# EAGLE schematic ACU rev1 (EAGLE 9.6.2)

## Sheet 1 of 5: Connectors, Power Fusing, TSAL
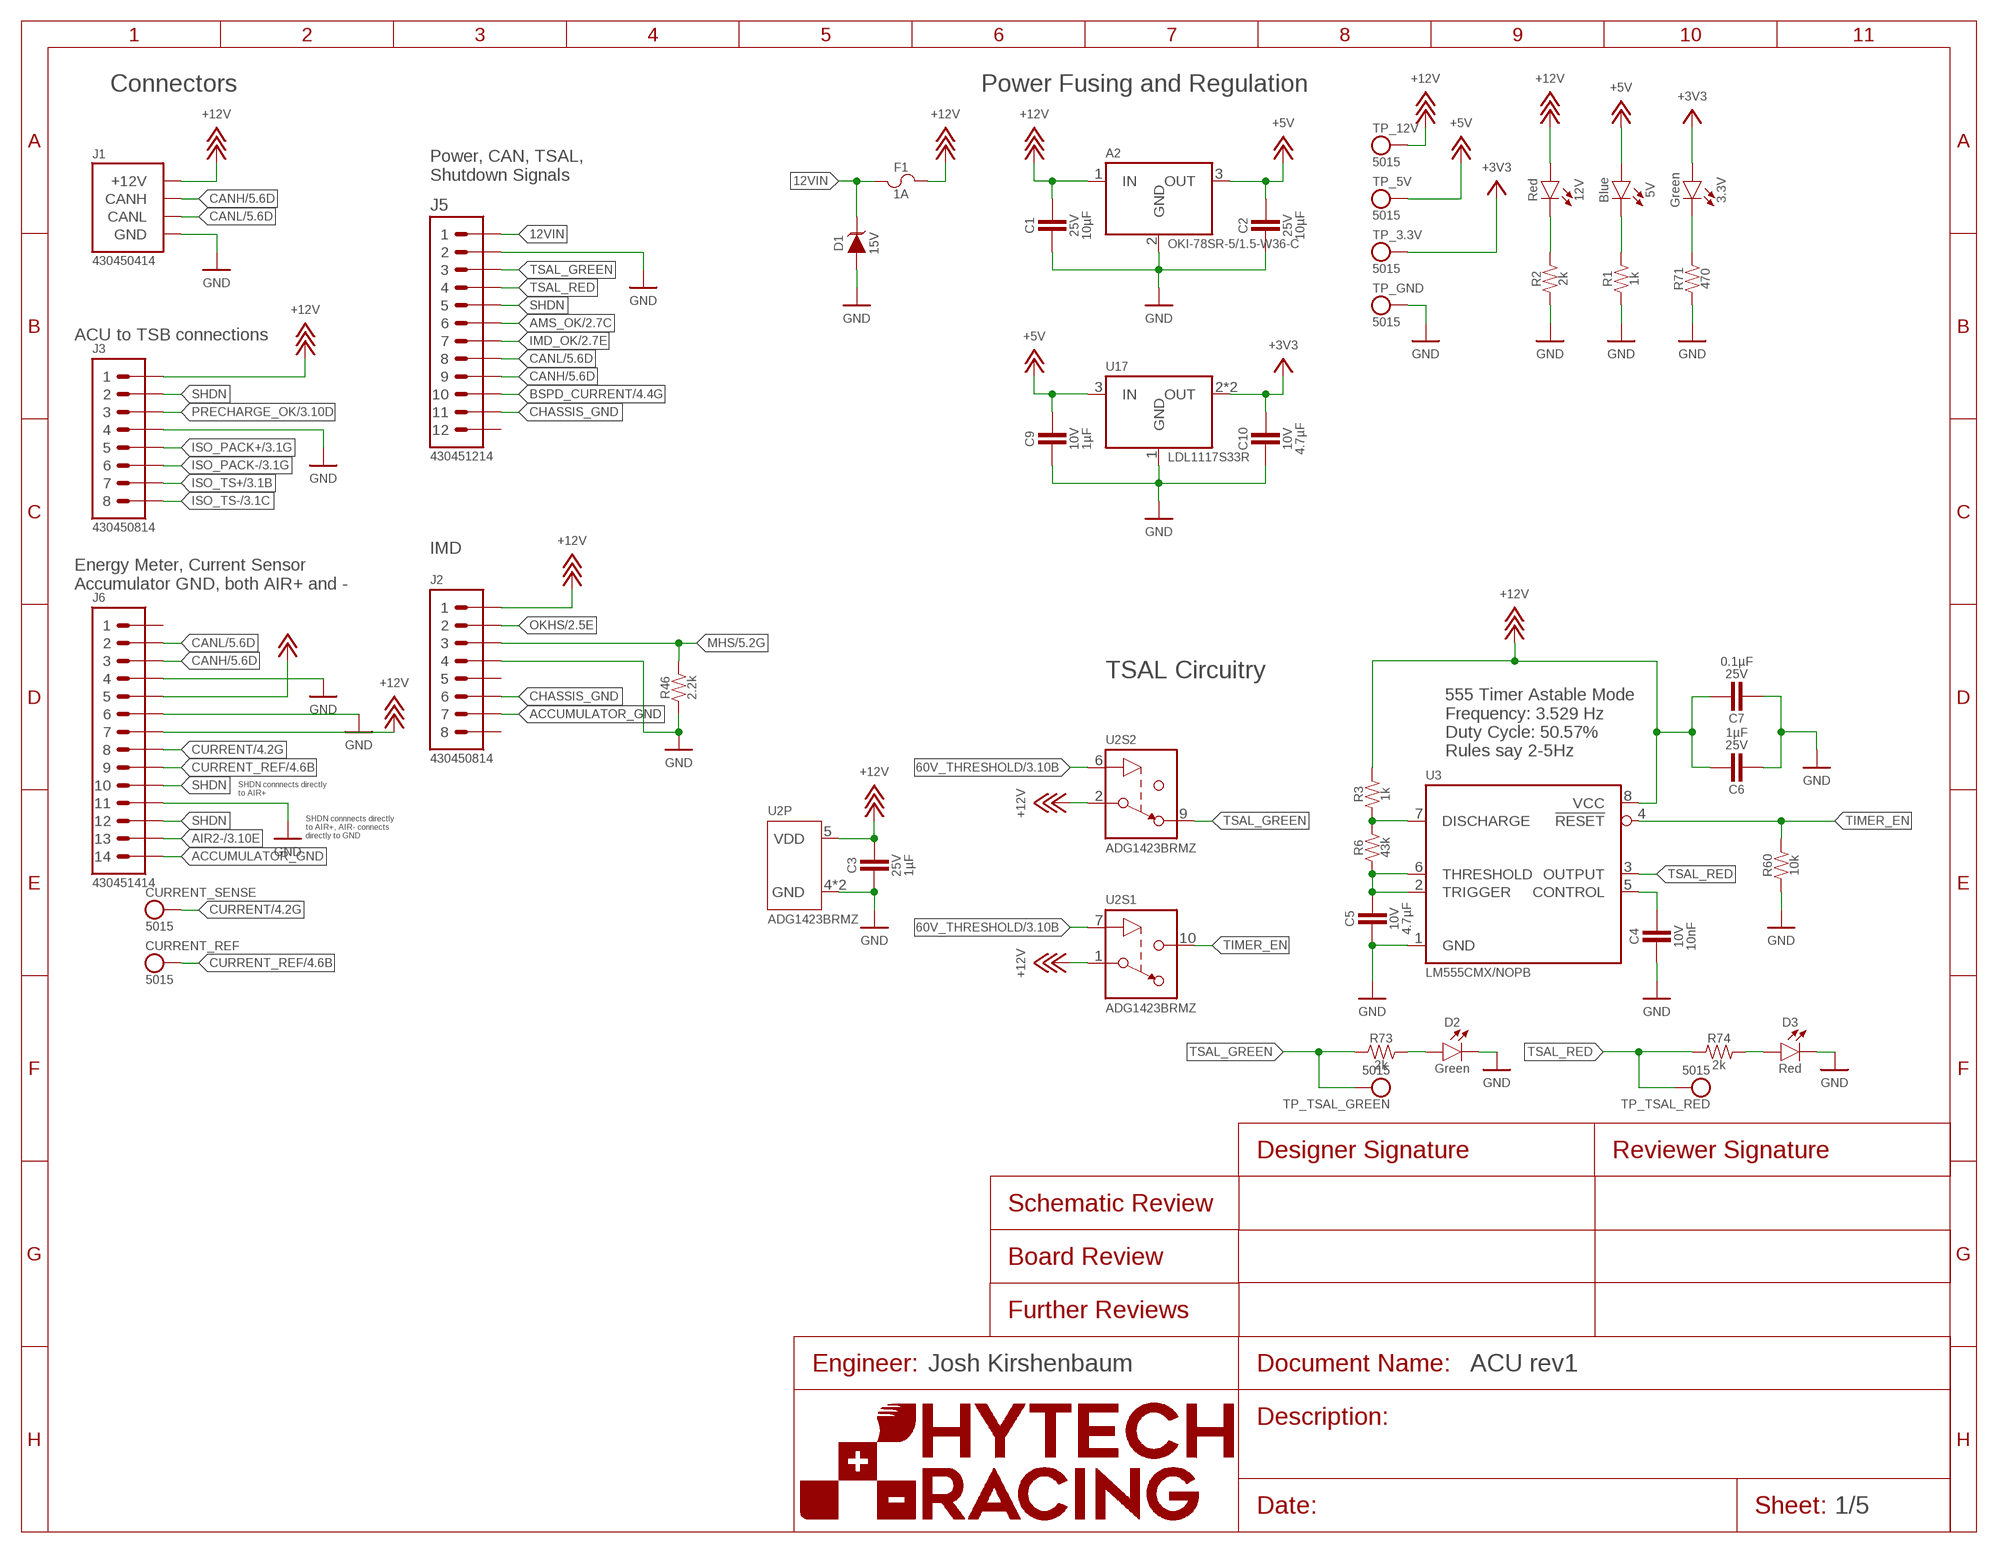
[diagram p0: schematic, sheet 1]

### Parts
3.3V  LED_0603_GREEN  [0603-LED]
5V  LED_0603_BLUE  [0603-LED]
12V  LED_0603_RED  [0603-LED]
A2  VOLTAGE_REGULATOR_MODULE_OKI-78SR_5V  [OKI-78SR]
C1  CAPACITOR_0603_25V_10UF  [0603-CAP]
C2  CAPACITOR_0603_25V_10UF  [0603-CAP]
C3  CAPACITOR_0603_25V_1UF  [0603-CAP]
C4  CAPACITOR_0603_10V_10NF  [0603-CAP]
C5  CAPACITOR_0603_10V_4.7UF  [0603-CAP]
C6  CAPACITOR_0603_25V_1UF  [0603-CAP]
C7  CAPACITOR_0603_25V_0.1UF  [0603-CAP]
C9  CAPACITOR_0603_10V_1UF  [0603-CAP]
C10  CAPACITOR_0603_10V_4.7UF  [0603-CAP]
CURRENT_REF  TEST_POINT  [MICRO_MINIATURE]
CURRENT_SENSE  TEST_POINT  [MICRO_MINIATURE]
D1  TVS_15V  [SOT-23]
D2  LED_0603_GREEN  [0603-LED]
D3  LED_0603_RED  [0603-LED]
F1  FUSE_MINI-BLADE_1A  [MINI-BLADE_FUSE_HOLDER]
J1  CONNECTOR-CAN_MF_T_V_  [MOLEX_MICROFIT_PTH_VERTICAL_04_DUAL]
J2  CONNECTOR-8_MF_T_V_  [MOLEX_MICROFIT_PTH_VERTICAL_08_DUAL]
J3  CONNECTOR-8_MF_T_V_  [MOLEX_MICROFIT_PTH_VERTICAL_08_DUAL]
J5  CONNECTOR-12_MF_T_V_  [MOLEX_MICROFIT_PTH_VERTICAL_12_DUAL]
J6  CONNECTOR-14_MF_T_V_  [MOLEX_MICROFIT_PTH_VERTICAL_14_DUAL]
R1  RESISTOR_0603_1K  [0603-RES]
R2  RESISTOR_0603_2K  [0603-RES]
R3  RESISTOR_0603_1K  [0603-RES]
R6  RESISTOR_0603_43K  [0603-RES]
R46  RESISTOR_0603_2.2K  [0603-RES]
R60  RESISTOR_0603_10K  [0603-RES]
R71  RESISTOR_0603_470  [0603-RES]
R73  RESISTOR_0603_2K  [0603-RES]
R74  RESISTOR_0603_2K  [0603-RES]
TP_3.3V  TEST_POINT  [MICRO_MINIATURE]
TP_5V  TEST_POINT  [MICRO_MINIATURE]
TP_12V  TEST_POINT  [MICRO_MINIATURE]
TP_GND  TEST_POINT  [MICRO_MINIATURE]
TP_TSAL_GREEN  TEST_POINT  [MICRO_MINIATURE]
TP_TSAL_RED  TEST_POINT  [MICRO_MINIATURE]
U2  ADG1423  [MSOP-10]
U3  LM555  [SOIC-08(NARROW,0.15")]
U17  VOLTAGE_REGULATOR_SOT223_3.3V  [SOT223]

### Nets
12VIN: D1.3(C) F1.L1 F1.L2 J5.1
60V_THRESHOLD: U2.6(S2:IN) U2.7(S1:IN) ; also sheet 3
+3V3: 3.3V.2(A) C10.1 TP_3.3V.1 U17.2(OUT) U17.4(OUT) ; also sheet 4,5
+5V: 5V.2(A) A2.3(OUT) C2.1 C9.1 J6.5 TP_5V.1 U17.3(IN) ; also sheet 3,5
+12V: 12V.2(A) A2.1(IN) C1.1 C3.1 C6.1 C7.1 F1.R1 F1.R2 J1.1(+12V) J2.1 J3.1 J6.7 R3.2 TP_12V.1 U2.1(S1:S) U2.2(S2:S) U2.5(P:VDD) U3.8(VCC) ; also sheet 2,4,5
ACCUMULATOR_GND: J2.7 J6.14
AIR2-: J6.13 ; also sheet 3
AMS_OK: J5.6 ; also sheet 2
BSPD_CURRENT: J5.10 ; also sheet 4,5
CANH: J1.4(CANH) J5.9 J6.3 ; also sheet 5
CANL: J1.3(CANL) J5.8 J6.2 ; also sheet 5
CHASSIS_GND: J2.6 J5.11
CURRENT: CURRENT_SENSE.1 J6.8 ; also sheet 4
CURRENT_REF: CURRENT_REF.1 J6.9 ; also sheet 4
GND: A2.2(GND) C1.2 C2.2 C3.2 C4.2 C5.2 C6.2 C7.2 C9.2 C10.2 D1.1(A) D2.1(C) D3.1(C) J1.2(GND) J2.4 J3.4 J5.2 J6.4 J6.6 J6.11 R1.1 R2.1 R46.1 R60.1 R71.1 TP_GND.1 U2.4(P:GND) U2.8(P:GND) U3.1(GND) U17.1(GND) ; also sheet 2,3,4,5
IMD_OK: J5.7 ; also sheet 2,5
ISO_PACK+: J3.5 ; also sheet 3
ISO_PACK-: J3.6 ; also sheet 3
ISO_TS+: J3.7 ; also sheet 3
ISO_TS-: J3.8 ; also sheet 3
MHS: J2.3 R46.2 ; also sheet 5
N$1: 3.3V.1(C) R71.2
N$2: 5V.1(C) R1.2
N$3: C5.1 R6.1 U3.2(TRIGGER) U3.6(THRESHOLD)
N$5: C4.1 U3.5(CONTROL)
N$6: R3.1 R6.2 U3.7(DISCHARGE)
N$14: 12V.1(C) R2.2
N$24: D2.2(A) R73.2
N$46: D3.2(A) R74.2
OKHS: J2.2 ; also sheet 2
PRECHARGE_OK: J3.3 ; also sheet 3,5
SHDN: J3.2 J5.5 J6.10 J6.12
TIMER_EN: R60.2 U2.10(S1:D) U3.4(!RESET)
TSAL_GREEN: J5.3 R73.1 TP_TSAL_GREEN.1 U2.9(S2:D)
TSAL_RED: J5.4 R74.1 TP_TSAL_RED.1 U3.3(OUTPUT)
Unconnected: J2.5 J2.8 J5.12 J6.1

### Notes on the sheet
- Connectors | Power Fusing and Regulation
- Power, CAN, TSAL, 
  Shutdown Signals
- ACU to TSB connections
- IMD
- Energy Meter, Current Sensor
  Accumulator GND, both AIR+ and -
- TSAL Circuitry
- 555 Timer Astable Mode
  Frequency: 3.529 Hz
  Duty Cycle: 50.57%
  Rules say 2-5Hz
- SHDN connnects directly
  to AIR+
- SHDN connnects directly
  to AIR+, AIR- connects
  directly to GND
- Josh Kirshenbaum

## Sheet 2 of 5: Shutdown Circuitry
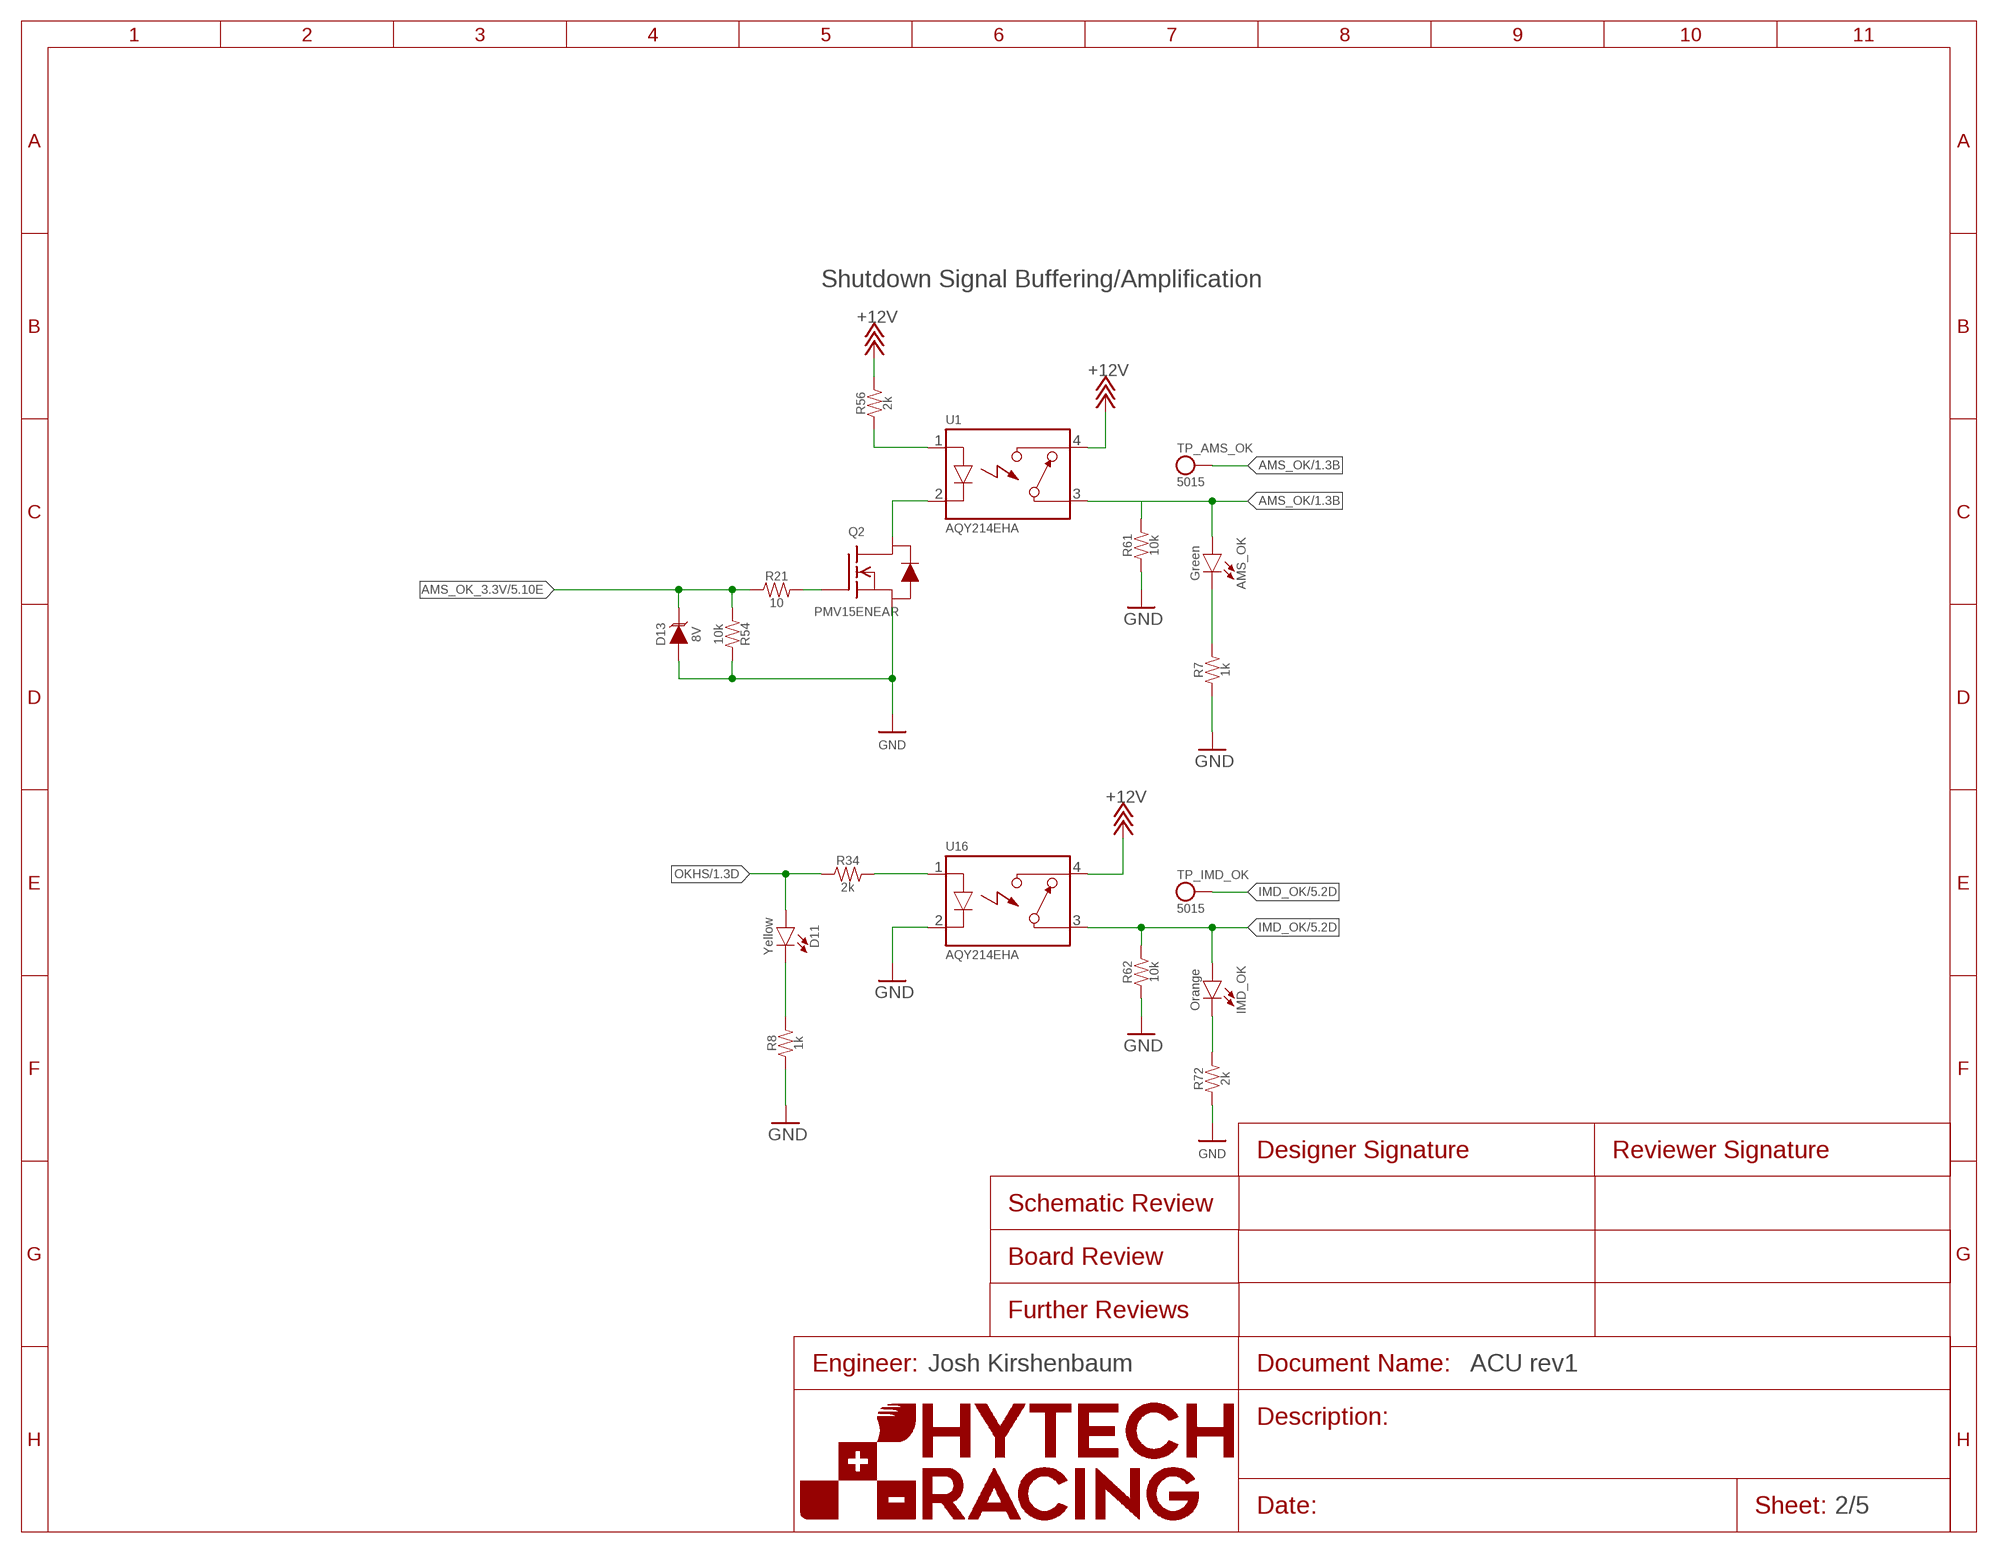
[diagram p1: schematic, sheet 2]

### Parts
AMS_OK  LED_0603_GREEN  [0603-LED]
D11  LED_0603_YELLOW  [0603-LED]
D13  TVS_8V  [SOT-23]
IMD_OK  LED_0603_ORANGE  [0603-LED]
Q2  TRANSISTOR_N_MOS__PMV15ENEA  [SOT-23]
R7  RESISTOR_0603_1K  [0603-RES]
R8  RESISTOR_0603_1K  [0603-RES]
R21  RESISTOR_0603_10  [0603-RES]
R34  RESISTOR_0603_2K  [0603-RES]
R54  RESISTOR_0603_10K  [0603-RES]
R56  RESISTOR_0603_2K  [0603-RES]
R61  RESISTOR_0603_10K  [0603-RES]
R62  RESISTOR_0603_10K  [0603-RES]
R72  RESISTOR_0603_2K  [0603-RES]
TP_AMS_OK  TEST_POINT  [MICRO_MINIATURE]
TP_IMD_OK  TEST_POINT  [MICRO_MINIATURE]
U1  RELAY_SOLIDSTATE_NO  [DIP-4]
U16  RELAY_SOLIDSTATE_NO  [DIP-4]

### Nets
+12V: R56.2 U1.4(CONTACT2) U16.4(CONTACT2) ; also sheet 1,4,5
AMS_OK: AMS_OK.2(A) R61.2 TP_AMS_OK.1 U1.3(CONTACT1) ; also sheet 1
AMS_OK_3.3V: D13.3(C) R21.1 R54.1 ; also sheet 5
GND: D13.1(A) Q2.2(S) R7.1 R8.1 R54.2 R61.1 R62.1 R72.1 U16.2(CONTROL-) ; also sheet 1,3,4,5
IMD_OK: IMD_OK.2(A) R62.2 TP_IMD_OK.1 U16.3(CONTACT1) ; also sheet 1,5
N$8: R34.2 U16.1(CONTROL+)
N$9: D11.1(C) R8.2
N$16: R56.1 U1.1(CONTROL+)
N$17: AMS_OK.1(C) R7.2
N$20: Q2.3(D) U1.2(CONTROL-)
N$27: IMD_OK.1(C) R72.2
N$30: Q2.1(G) R21.2
OKHS: D11.2(A) R34.1 ; also sheet 1

### Notes on the sheet
- Shutdown Signal Buffering/Amplification
- Josh Kirshenbaum

## Sheet 3 of 5: Precharge Circuit
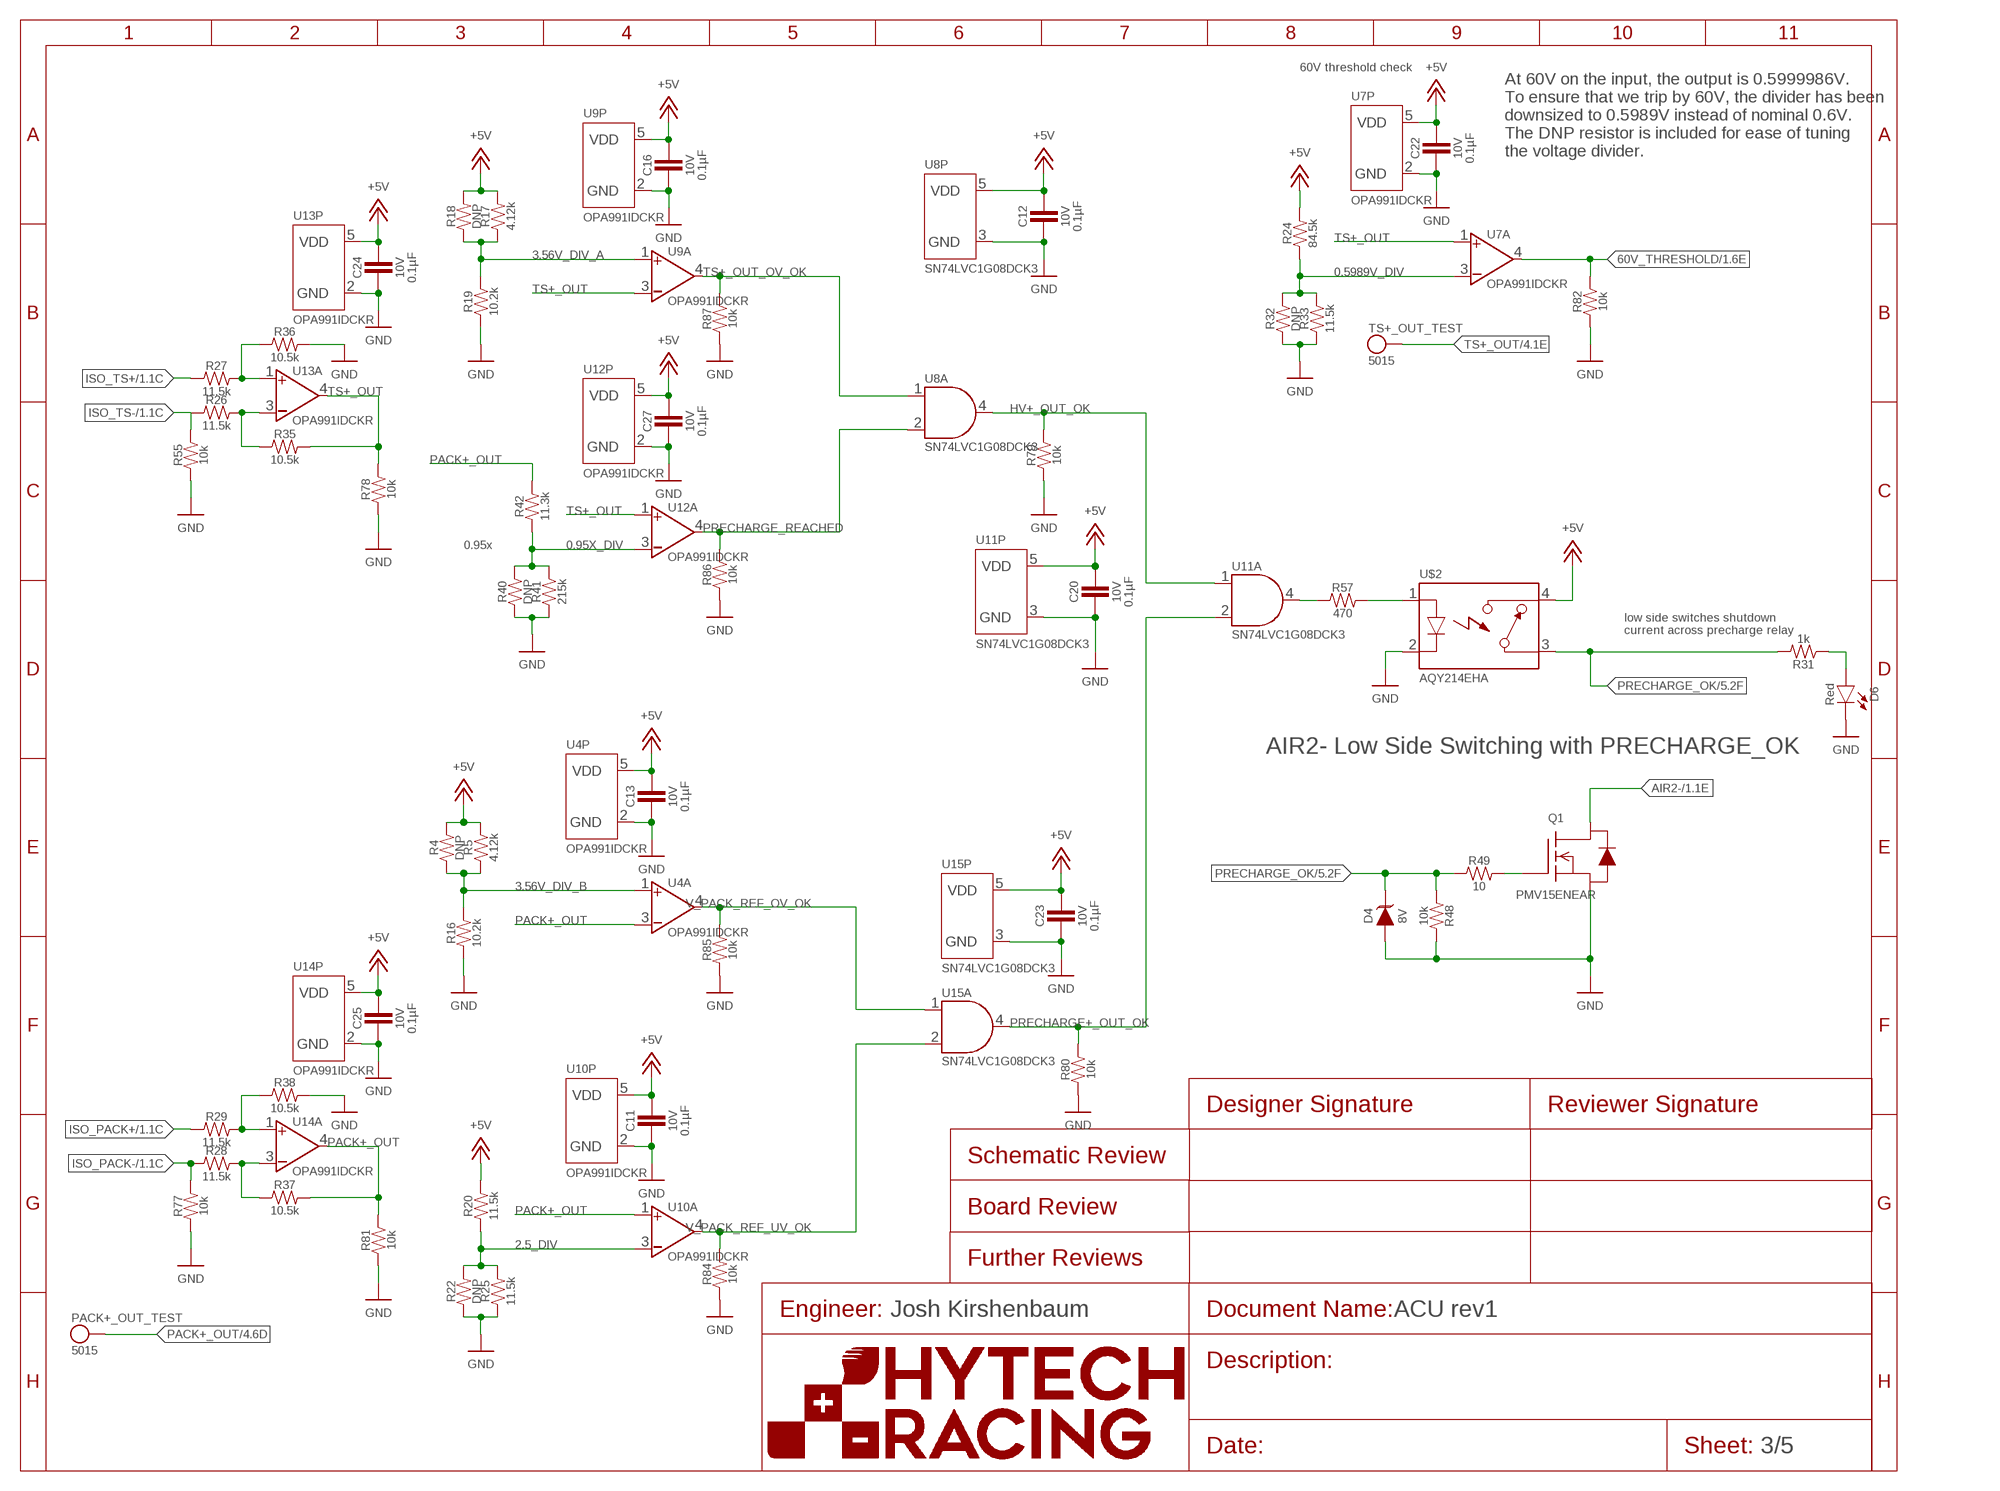
[diagram p2: schematic, sheet 3]

### Parts
C11  CAPACITOR_0603_10V_0.1UF  [0603-CAP]
C12  CAPACITOR_0603_10V_0.1UF  [0603-CAP]
C13  CAPACITOR_0603_10V_0.1UF  [0603-CAP]
C16  CAPACITOR_0603_10V_0.1UF  [0603-CAP]
C20  CAPACITOR_0603_10V_0.1UF  [0603-CAP]
C22  CAPACITOR_0603_10V_0.1UF  [0603-CAP]
C23  CAPACITOR_0603_10V_0.1UF  [0603-CAP]
C24  CAPACITOR_0603_10V_0.1UF  [0603-CAP]
C25  CAPACITOR_0603_10V_0.1UF  [0603-CAP]
C27  CAPACITOR_0603_10V_0.1UF  [0603-CAP]
D4  TVS_8V  [SOT-23]
D6  LED_0603_RED  [0603-LED]
PACK+_OUT_TEST  TEST_POINT  [MICRO_MINIATURE]
Q1  TRANSISTOR_N_MOS__PMV15ENEA  [SOT-23]
R4  RESISTOR_0603_DNP  [0603-RES]
R5  RESISTOR_0603_4.12K  [0603-RES]
R16  RESISTOR_0603_10.2K  [0603-RES]
R17  RESISTOR_0603_4.12K  [0603-RES]
R18  RESISTOR_0603_DNP  [0603-RES]
R19  RESISTOR_0603_10.2K  [0603-RES]
R20  RESISTOR_0603_11.5K  [0603-RES]
R22  RESISTOR_0603_DNP  [0603-RES]
R24  RESISTOR_0603_84.5K  [0603-RES]
R25  RESISTOR_0603_11.5K  [0603-RES]
R26  RESISTOR_0603_11.5K  [0603-RES]
R27  RESISTOR_0603_11.5K  [0603-RES]
R28  RESISTOR_0603_11.5K  [0603-RES]
R29  RESISTOR_0603_11.5K  [0603-RES]
R31  RESISTOR_0603_1K  [0603-RES]
R32  RESISTOR_0603_DNP  [0603-RES]
R33  RESISTOR_0603_11.5K  [0603-RES]
R35  RESISTOR_0603_10.5K  [0603-RES]
R36  RESISTOR_0603_10.5K  [0603-RES]
R37  RESISTOR_0603_10.5K  [0603-RES]
R38  RESISTOR_0603_10.5K  [0603-RES]
R40  RESISTOR_0603_DNP  [0603-RES]
R41  RESISTOR_0603_215K  [0603-RES]
R42  RESISTOR_0603_11.3K  [0603-RES]
R48  RESISTOR_0603_10K  [0603-RES]
R49  RESISTOR_0603_10  [0603-RES]
R55  RESISTOR_0603_10K  [0603-RES]
R57  RESISTOR_0603_470  [0603-RES]
R77  RESISTOR_0603_10K  [0603-RES]
R78  RESISTOR_0603_10K  [0603-RES]
R79  RESISTOR_0603_10K  [0603-RES]
R80  RESISTOR_0603_10K  [0603-RES]
R81  RESISTOR_0603_10K  [0603-RES]
R82  RESISTOR_0603_10K  [0603-RES]
R84  RESISTOR_0603_10K  [0603-RES]
R85  RESISTOR_0603_10K  [0603-RES]
R86  RESISTOR_0603_10K  [0603-RES]
R87  RESISTOR_0603_10K  [0603-RES]
TS+_OUT_TEST  TEST_POINT  [MICRO_MINIATURE]
U4  OPAMP_1_CHANNEL_OPA991  [SC-70-5]
U7  OPAMP_1_CHANNEL_OPA991  [SC-70-5]
U8  LOGICGATE_AND_DCK3  [SC-70-5]
U9  OPAMP_1_CHANNEL_OPA991  [SC-70-5]
U10  OPAMP_1_CHANNEL_OPA991  [SC-70-5]
U11  LOGICGATE_AND_DCK3  [SC-70-5]
U12  OPAMP_1_CHANNEL_OPA991  [SC-70-5]
U13  OPAMP_1_CHANNEL_OPA991  [SC-70-5]
U14  OPAMP_1_CHANNEL_OPA991  [SC-70-5]
U15  LOGICGATE_AND_DCK3  [SC-70-5]
U$2  RELAY_SOLIDSTATE_NO  [DIP-4]

### Nets
0.95X_DIV: R40.2 R41.2 R42.1 U12.3(A:VIN-)
0.5989V_DIV: R24.1 R32.2 R33.2 U7.3(A:VIN-)
2.5_DIV: R20.1 R22.2 R25.2 U10.3(A:VIN-)
3.56V_DIV_A: R17.1 R18.1 R19.2 U9.1(A:VIN+)
3.56V_DIV_B: R4.1 R5.1 R16.2 U4.1(A:VIN+)
60V_THRESHOLD: R82.2 U7.4(A:VOUT) ; also sheet 1
+5V: C11.1 C12.1 C13.1 C16.1 C20.1 C22.1 C23.1 C24.1 C25.1 C27.1 R4.2 R5.2 R17.2 R18.2 R20.2 R24.2 U4.5(P:VDD) U7.5(P:VDD) U8.5(P:VDD) U9.5(P:VDD) U10.5(P:VDD) U11.5(P:VDD) U12.5(P:VDD) U13.5(P:VDD) U14.5(P:VDD) U15.5(P:VDD) U$2.4(CONTACT2) ; also sheet 1,5
AIR2-: Q1.3(D) ; also sheet 1
GND: C11.2 C12.2 C13.2 C16.2 C20.2 C22.2 C23.2 C24.2 C25.2 C27.2 D4.1(A) D6.1(C) Q1.2(S) R16.1 R19.1 R22.1 R25.1 R32.1 R33.1 R36.2 R38.2 R40.1 R41.1 R48.2 R55.1 R77.1 R78.1 R79.1 R80.1 R81.1 R82.1 R84.1 R85.1 R86.1 R87.1 U4.2(P:GND) U7.2(P:GND) U8.3(P:GND) U9.2(P:GND) U10.2(P:GND) U11.3(P:GND) U12.2(P:GND) U13.2(P:GND) U14.2(P:GND) U15.3(P:GND) U$2.2(CONTROL-) ; also sheet 1,2,4,5
HV+_OUT_OK: R79.2 U8.4(A:OUT) U11.1(A:IN1)
ISO_PACK+: R29.1 ; also sheet 1
ISO_PACK-: R28.1 R77.2 ; also sheet 1
ISO_TS+: R27.1 ; also sheet 1
ISO_TS-: R26.1 R55.2 ; also sheet 1
N$4: D6.2(A) R31.1
N$7: Q1.1(G) R49.2
N$10: R27.2 R36.1 U13.1(A:VIN+)
N$11: R26.2 R35.1 U13.3(A:VIN-)
N$22: R29.2 R38.1 U14.1(A:VIN+)
N$23: R28.2 R37.1 U14.3(A:VIN-)
N$41: R57.1 U11.4(A:OUT)
N$49: R57.2 U$2.1(CONTROL+)
PACK+_OUT: PACK+_OUT_TEST.1 R37.2 R42.2 R81.2 U4.3(A:VIN-) U10.1(A:VIN+) U14.4(A:VOUT) ; also sheet 4
PRECHARGE+_OUT_OK: R80.2 U11.2(A:IN2) U15.4(A:OUT)
PRECHARGE_OK: D4.3(C) R31.2 R48.1 R49.1 U$2.3(CONTACT1) ; also sheet 1,5
PRECHARGE_REACHED: R86.2 U8.2(A:IN2) U12.4(A:VOUT)
TS+_OUT: R35.2 R78.2 TS+_OUT_TEST.1 U7.1(A:VIN+) U9.3(A:VIN-) U12.1(A:VIN+) U13.4(A:VOUT) ; also sheet 4
TS+_OUT_OV_OK: R87.2 U8.1(A:IN1) U9.4(A:VOUT)
V_PACK_REF_OV_OK: R85.2 U4.4(A:VOUT) U15.1(A:IN1)
V_PACK_REF_UV_OK: R84.2 U10.4(A:VOUT) U15.2(A:IN2)

### Notes on the sheet
- 60V threshold check
- At 60V on the input, the output is 0.5999986V.
  To ensure that we trip by 60V, the divider has been
  downsized to 0.5989V instead of nominal 0.6V.
  The DNP resistor is included for ease of tuning
  the voltage divider.
- 0.95x
- low side switches shutdown 
  current across precharge relay
- AIR2- Low Side Switching with PRECHARGE_OK
- Josh Kirshenbaum

## Sheet 4 of 5: Analog Filtering
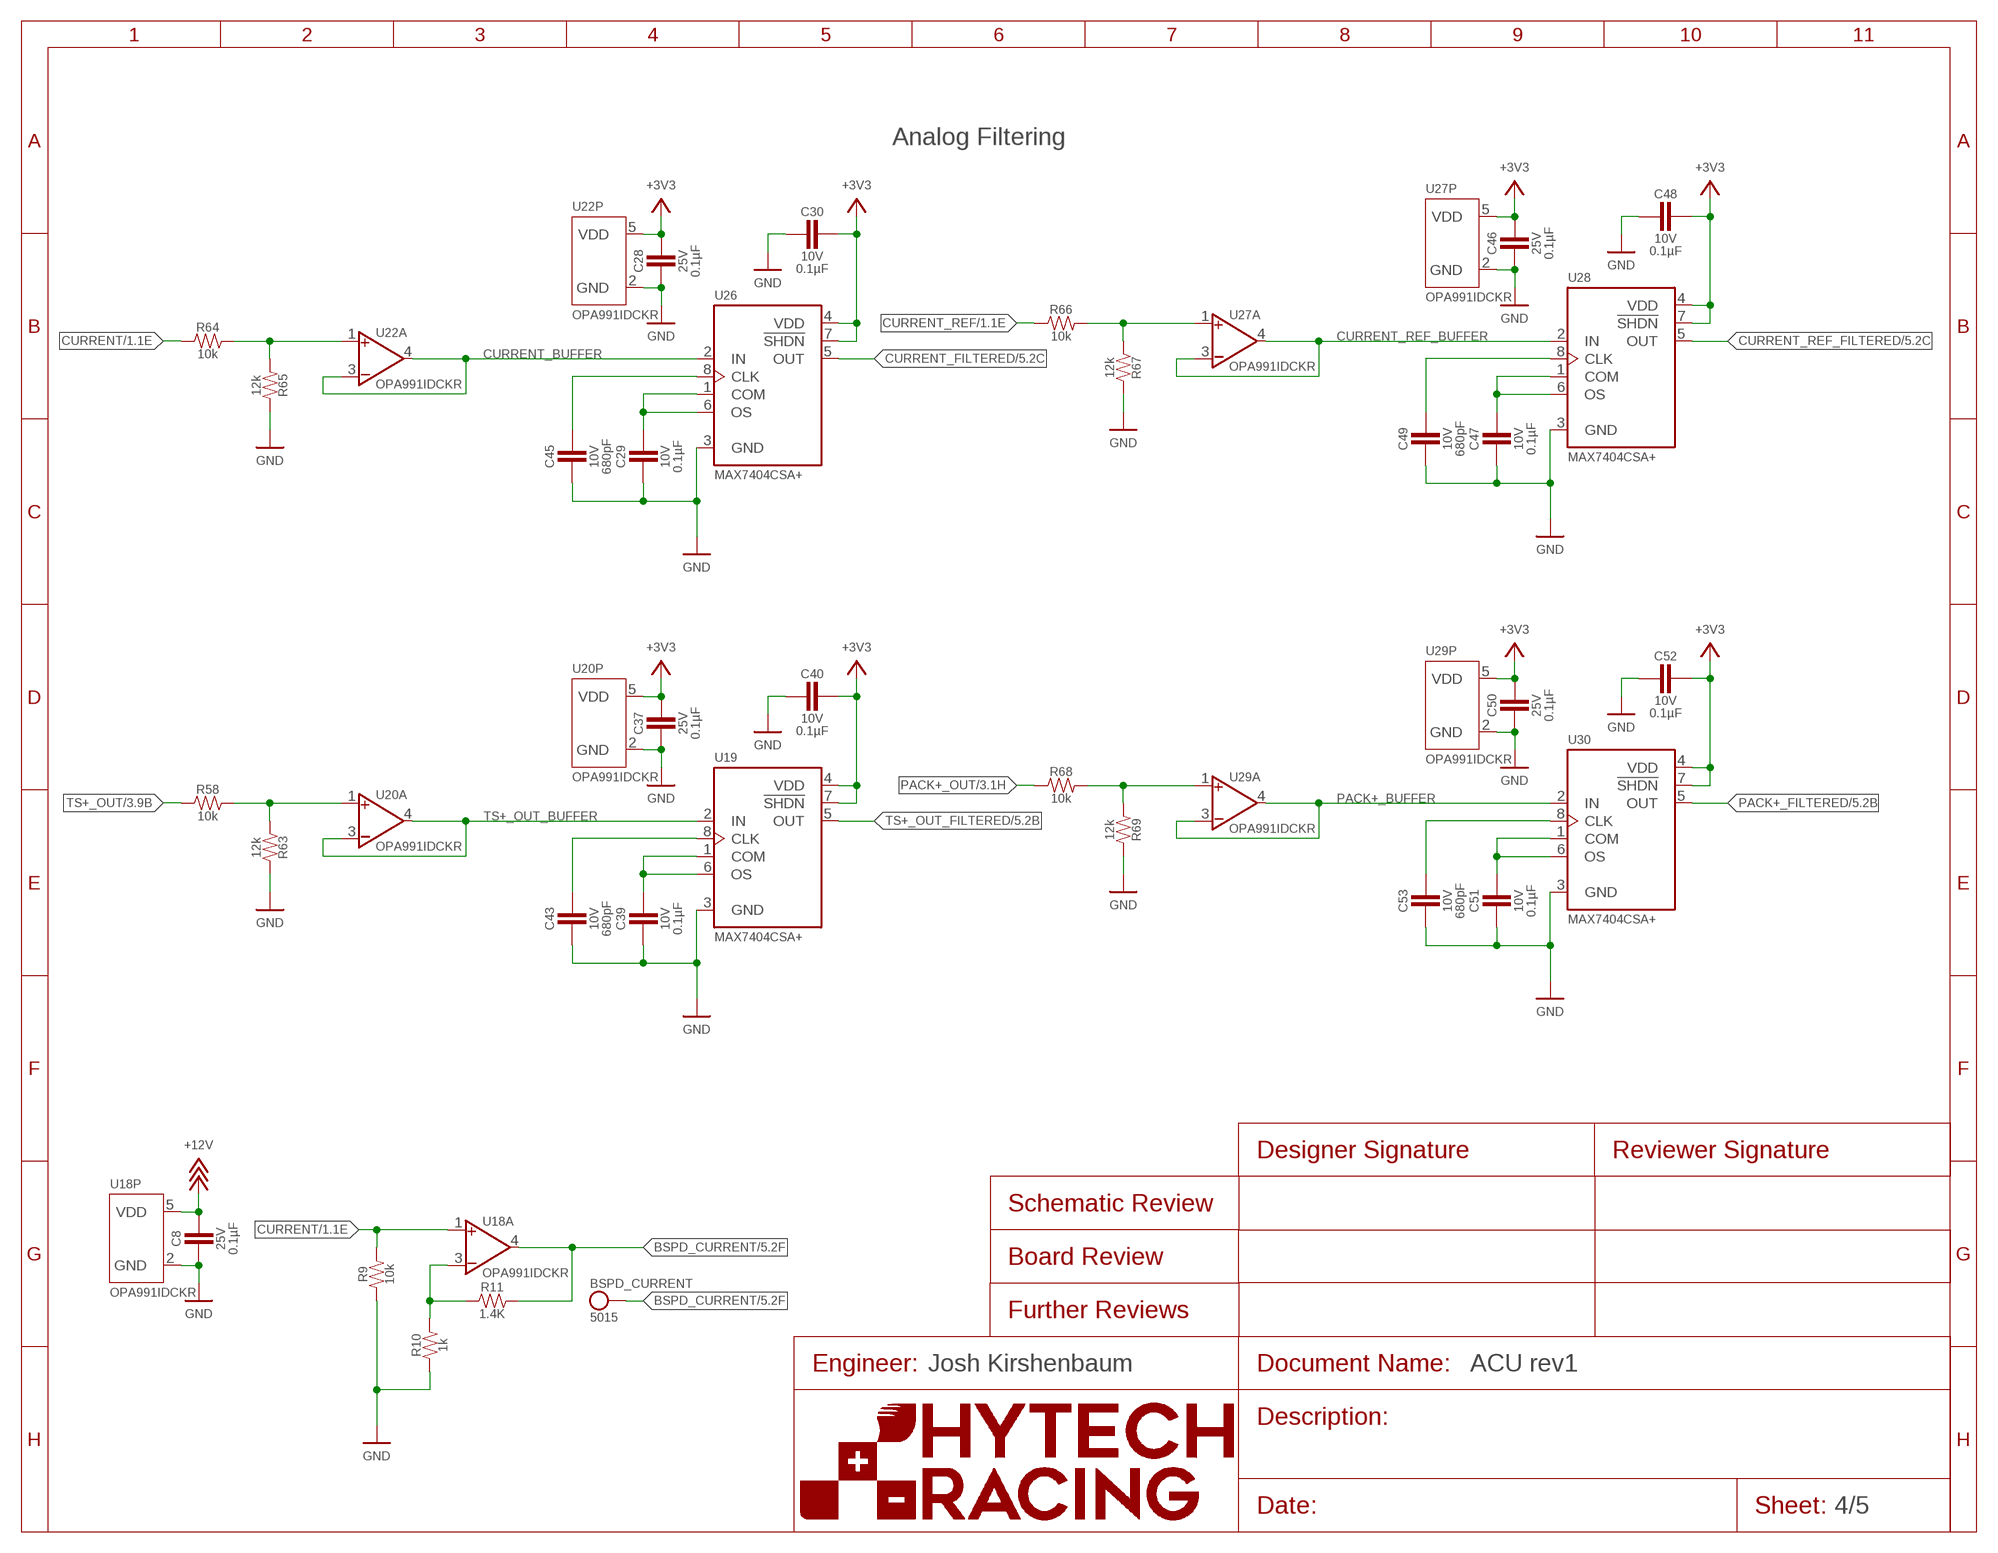
[diagram p3: schematic, sheet 4]

### Parts
BSPD_CURRENT  TEST_POINT  [MICRO_MINIATURE]
C8  CAPACITOR_0603_25V_0.1UF  [0603-CAP]
C28  CAPACITOR_0603_25V_0.1UF  [0603-CAP]
C29  CAPACITOR_0603_10V_0.1UF  [0603-CAP]
C30  CAPACITOR_0603_10V_0.1UF  [0603-CAP]
C37  CAPACITOR_0603_25V_0.1UF  [0603-CAP]
C39  CAPACITOR_0603_10V_0.1UF  [0603-CAP]
C40  CAPACITOR_0603_10V_0.1UF  [0603-CAP]
C43  CAPACITOR_0603_10V_680PF  [0603-CAP]
C45  CAPACITOR_0603_10V_680PF  [0603-CAP]
C46  CAPACITOR_0603_25V_0.1UF  [0603-CAP]
C47  CAPACITOR_0603_10V_0.1UF  [0603-CAP]
C48  CAPACITOR_0603_10V_0.1UF  [0603-CAP]
C49  CAPACITOR_0603_10V_680PF  [0603-CAP]
C50  CAPACITOR_0603_25V_0.1UF  [0603-CAP]
C51  CAPACITOR_0603_10V_0.1UF  [0603-CAP]
C52  CAPACITOR_0603_10V_0.1UF  [0603-CAP]
C53  CAPACITOR_0603_10V_680PF  [0603-CAP]
R9  RESISTOR_0603_10K  [0603-RES]
R10  RESISTOR_0603_1K  [0603-RES]
R11  RESISTOR_0603_1.4K  [0603-RES]
R58  RESISTOR_0603_10K  [0603-RES]
R63  RESISTOR_0603_12K  [0603-RES]
R64  RESISTOR_0603_10K  [0603-RES]
R65  RESISTOR_0603_12K  [0603-RES]
R66  RESISTOR_0603_10K  [0603-RES]
R67  RESISTOR_0603_12K  [0603-RES]
R68  RESISTOR_0603_10K  [0603-RES]
R69  RESISTOR_0603_12K  [0603-RES]
U18  OPAMP_1_CHANNEL_OPA991  [SC-70-5]
U19  MAX7404  [SOIC-08(NARROW,0.15")]
U20  OPAMP_1_CHANNEL_OPA991  [SC-70-5]
U22  OPAMP_1_CHANNEL_OPA991  [SC-70-5]
U26  MAX7404  [SOIC-08(NARROW,0.15")]
U27  OPAMP_1_CHANNEL_OPA991  [SC-70-5]
U28  MAX7404  [SOIC-08(NARROW,0.15")]
U29  OPAMP_1_CHANNEL_OPA991  [SC-70-5]
U30  MAX7404  [SOIC-08(NARROW,0.15")]

### Nets
+3V3: C28.1 C30.1 C37.1 C40.1 C46.1 C48.1 C50.1 C52.1 U19.4(VDD) U19.7(!SHDN) U20.5(P:VDD) U22.5(P:VDD) U26.4(VDD) U26.7(!SHDN) U27.5(P:VDD) U28.4(VDD) U28.7(!SHDN) U29.5(P:VDD) U30.4(VDD) U30.7(!SHDN) ; also sheet 1,5
+12V: C8.1 U18.5(P:VDD) ; also sheet 1,2,5
BSPD_CURRENT: BSPD_CURRENT.1 R11.2 U18.4(A:VOUT) ; also sheet 1,5
CURRENT: R9.2 R64.1 U18.1(A:VIN+) ; also sheet 1
CURRENT_BUFFER: U22.3(A:VIN-) U22.4(A:VOUT) U26.2(IN)
CURRENT_FILTERED: U26.5(OUT) ; also sheet 5
CURRENT_REF: R66.1 ; also sheet 1
CURRENT_REF_BUFFER: U27.3(A:VIN-) U27.4(A:VOUT) U28.2(IN)
CURRENT_REF_FILTERED: U28.5(OUT) ; also sheet 5
GND: C8.2 C28.2 C29.2 C30.2 C37.2 C39.2 C40.2 C43.2 C45.2 C46.2 C47.2 C48.2 C49.2 C50.2 C51.2 C52.2 C53.2 R9.1 R10.1 R63.2 R65.2 R67.2 R69.2 U18.2(P:GND) U19.3(GND) U20.2(P:GND) U22.2(P:GND) U26.3(GND) U27.2(P:GND) U28.3(GND) U29.2(P:GND) U30.3(GND) ; also sheet 1,2,3,5
N$12: R10.2 R11.1 U18.3(A:VIN-)
N$26: C39.1 U19.1(COM) U19.6(OS)
N$45: C43.1 U19.8(CLK)
N$48: R58.2 R63.1 U20.1(A:VIN+)
N$50: C29.1 U26.1(COM) U26.6(OS)
N$51: C45.1 U26.8(CLK)
N$52: R64.2 R65.1 U22.1(A:VIN+)
N$53: C47.1 U28.1(COM) U28.6(OS)
N$54: C49.1 U28.8(CLK)
N$55: R66.2 R67.1 U27.1(A:VIN+)
N$56: C51.1 U30.1(COM) U30.6(OS)
N$57: C53.1 U30.8(CLK)
N$58: R68.2 R69.1 U29.1(A:VIN+)
PACK+_BUFFER: U29.3(A:VIN-) U29.4(A:VOUT) U30.2(IN)
PACK+_FILTERED: U30.5(OUT) ; also sheet 5
PACK+_OUT: R68.1 ; also sheet 3
TS+_OUT: R58.1 ; also sheet 3
TS+_OUT_BUFFER: U19.2(IN) U20.3(A:VIN-) U20.4(A:VOUT)
TS+_OUT_FILTERED: U19.5(OUT) ; also sheet 5

### Notes on the sheet
- Analog Filtering
- Josh Kirshenbaum

## Sheet 5 of 5: Teensy, LTC6820, CAN, Watchdog
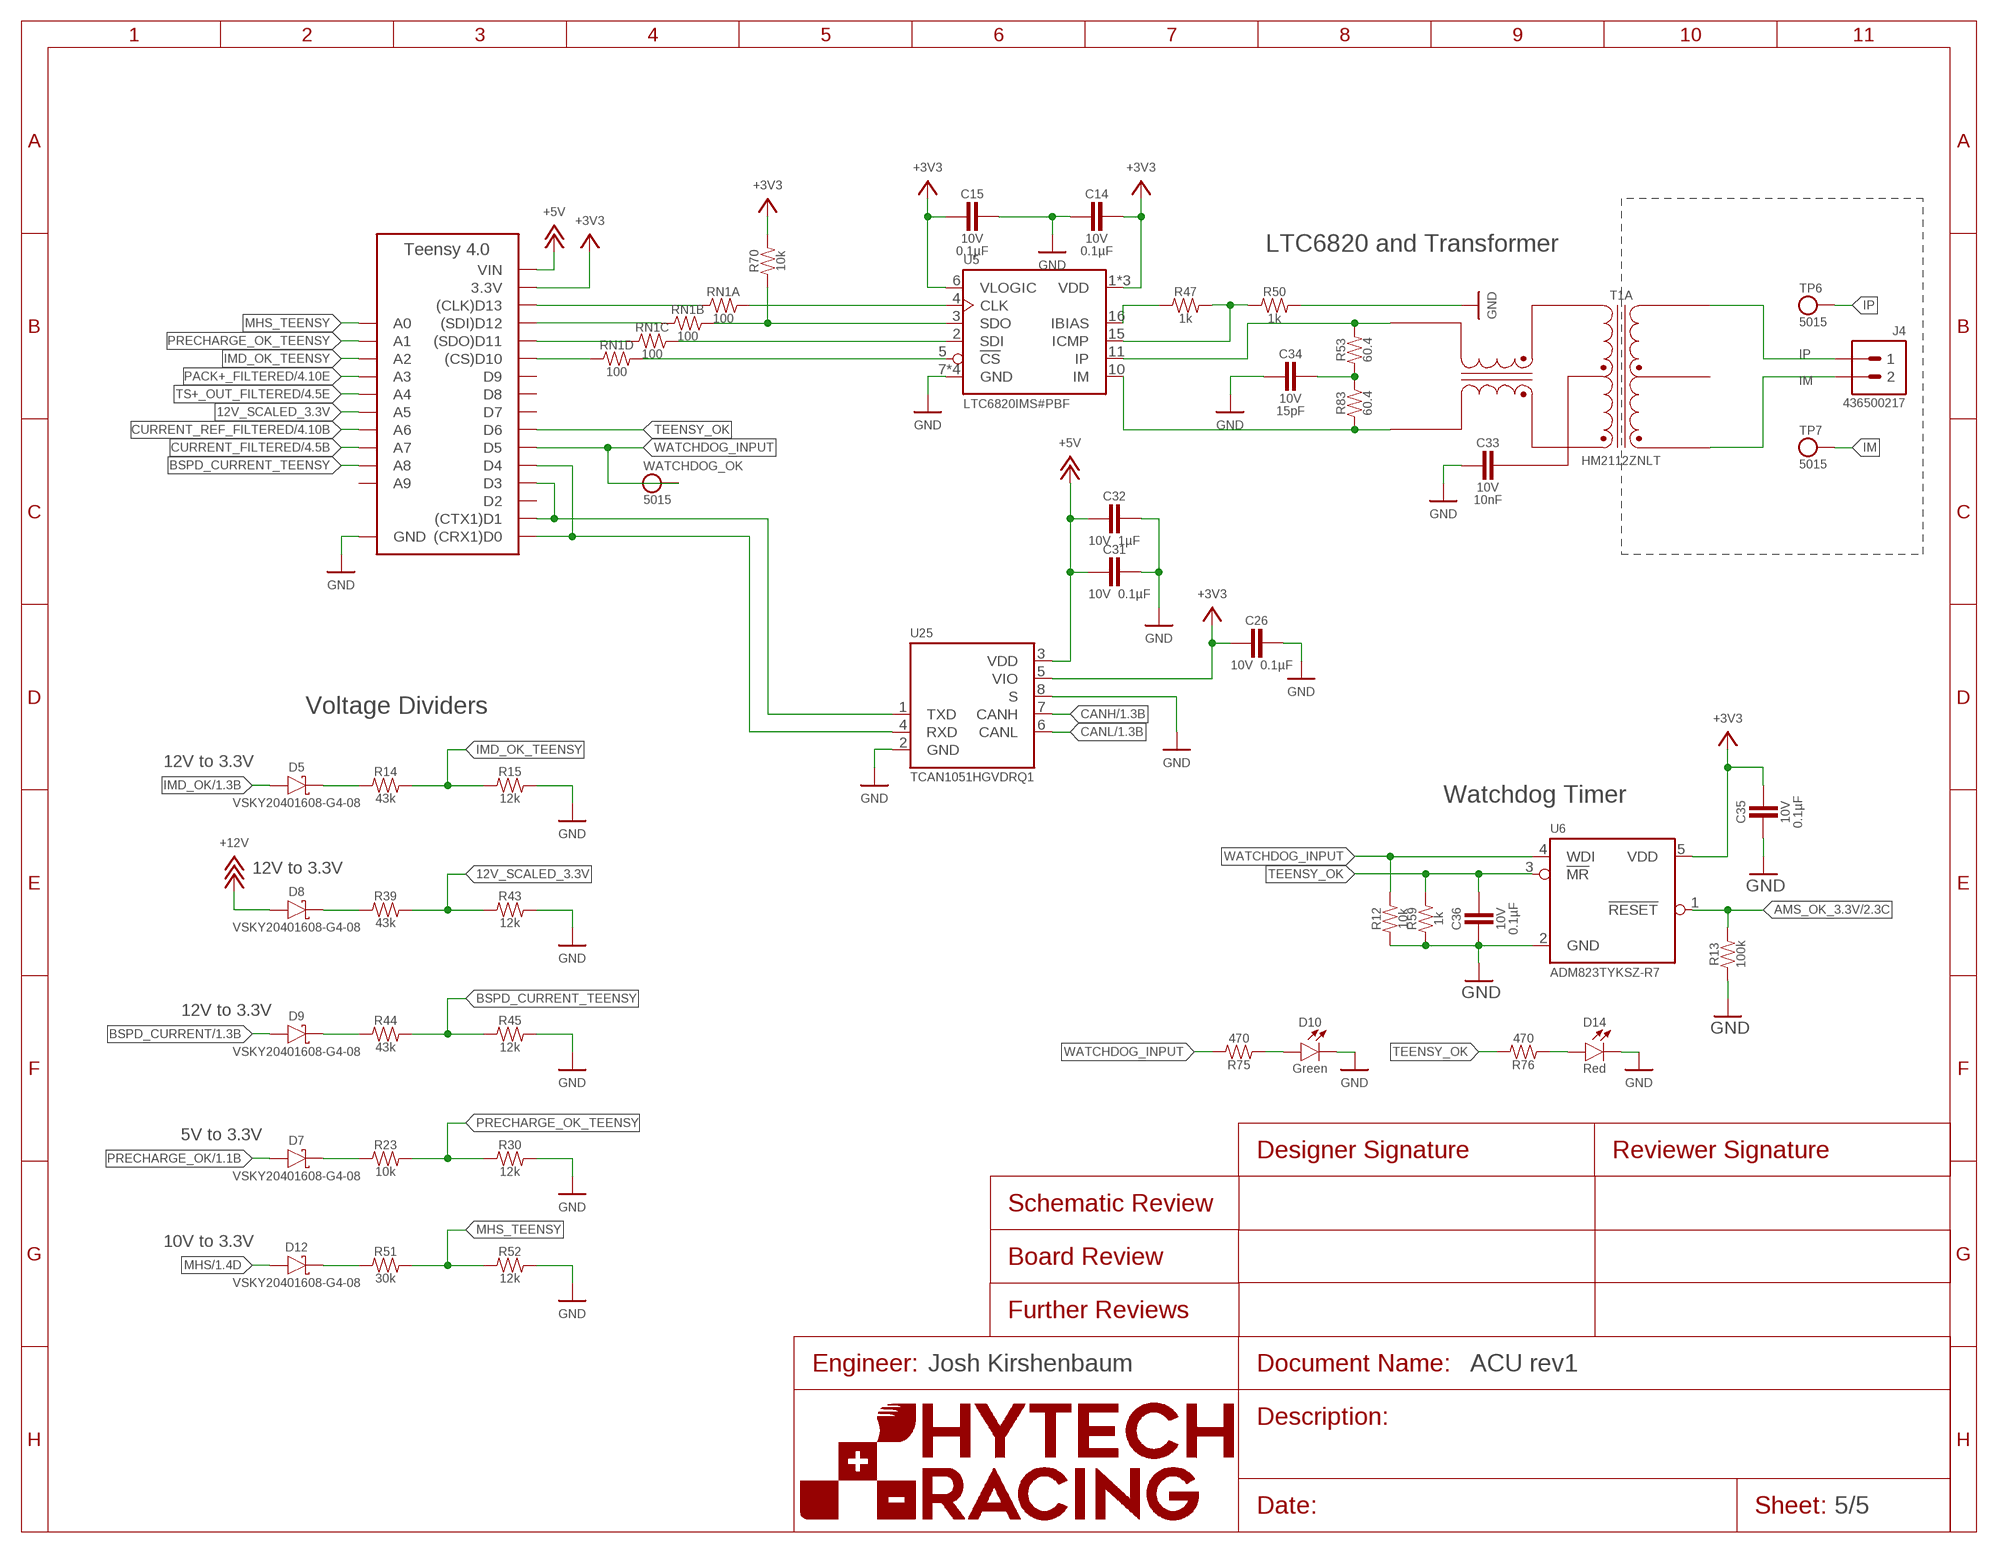
[diagram p4: schematic, sheet 5]

### Parts
A1  TEENSY_4.0  [TEENSY_SHORT]
C14  CAPACITOR_0603_10V_0.1UF  [0603-CAP]
C15  CAPACITOR_0603_10V_0.1UF  [0603-CAP]
C26  CAPACITOR_0603_10V_0.1UF  [0603-CAP]
C31  CAPACITOR_0603_10V_0.1UF  [0603-CAP]
C32  CAPACITOR_0603_10V_1UF  [0603-CAP]
C33  CAPACITOR_0603_10V_10NF  [0603-CAP]
C34  CAPACITOR_0603_10V_15PF  [0603-CAP]
C35  CAPACITOR_0603_10V_0.1UF  [0603-CAP]
C36  CAPACITOR_0603_10V_0.1UF  [0603-CAP]
D5  SCHOTTKY  [CLP1608-2L]
D7  SCHOTTKY  [CLP1608-2L]
D8  SCHOTTKY  [CLP1608-2L]
D9  SCHOTTKY  [CLP1608-2L]
D10  LED_0603_GREEN  [0603-LED]
D12  SCHOTTKY  [CLP1608-2L]
D14  LED_0603_RED  [0603-LED]
J4  CONNECTOR-2_MF_T_V_  [MOLEX_MICROFIT_PTH_VERTICAL_02_SINGLE]
R12  RESISTOR_0603_10K  [0603-RES]
R13  RESISTOR_0603_100K  [0603-RES]
R14  RESISTOR_0603_43K  [0603-RES]
R15  RESISTOR_0603_12K  [0603-RES]
R23  RESISTOR_0603_10K  [0603-RES]
R30  RESISTOR_0603_12K  [0603-RES]
R39  RESISTOR_0603_43K  [0603-RES]
R43  RESISTOR_0603_12K  [0603-RES]
R44  RESISTOR_0603_43K  [0603-RES]
R45  RESISTOR_0603_12K  [0603-RES]
R47  RESISTOR_0603_1K  [0603-RES]
R50  RESISTOR_0603_1K  [0603-RES]
R51  RESISTOR_0603_30K  [0603-RES]
R52  RESISTOR_0603_12K  [0603-RES]
R53  RESISTOR_0603_60.4  [0603-RES]
R59  RESISTOR_0603_1K  [0603-RES]
R70  RESISTOR_0603_10K  [0603-RES]
R75  RESISTOR_0603_470  [0603-RES]
R76  RESISTOR_0603_470  [0603-RES]
R83  RESISTOR_0603_60.4  [0603-RES]
RN1  RESISTOR_NETWORK_4_100  [1206-RES-ARRAY]
T1  TRANSFORMER_HM2112ZNLT_AIRGAP  [HM2112ZNLT_AIRGAP]
TP6  TEST_POINT  [MICRO_MINIATURE]
TP7  TEST_POINT  [MICRO_MINIATURE]
U5  LTC6820  [MSOP-16]
U6  ADM823  [SC-70-5]
U25  TCAN1051HQV-Q1  [SOIC-08(NARROW,0.15")]
WATCHDOG_OK  TEST_POINT  [MICRO_MINIATURE]

### Nets
12V_SCALED_3.3V: A1.D19(A5) R39.2 R43.1
+3V3: A1.3.3V C14.1 C15.2 C26.2 C35.1 R70.2 U5.1(VDD) U5.6(VLOGIC) U5.9(VDD) U5.12(VDD) U6.5(VDD) U25.5(VIO) ; also sheet 1,4
+5V: A1.VIN C31.2 C32.2 U25.3(VDD) ; also sheet 1,3
+12V: D8.1(A) ; also sheet 1,2,4
AMS_OK_3.3V: R13.2 U6.1(!RESET!) ; also sheet 2
BSPD_CURRENT: D9.1(A) ; also sheet 1,4
BSPD_CURRENT_TEENSY: A1.D22(A8) R44.2 R45.1
CANH: U25.7(CANH) ; also sheet 1
CANL: U25.6(CANL) ; also sheet 1
CS_LTC_6820: RN1.5 U5.5(!CS)
CURRENT_FILTERED: A1.D21(A7) ; also sheet 4
CURRENT_REF_FILTERED: A1.D20(A6) ; also sheet 4
GND: A1.AGND/GND(GND) A1.GND C14.2 C15.1 C26.1 C31.1 C32.1 C33.2 C34.2 C35.2 C36.2 D10.1(C) D14.1(C) R12.1 R13.1 R15.2 R30.2 R43.2 R45.2 R50.2 R52.2 R59.1 U5.7(GND) U5.8(GND) U5.13(GND) U5.14(GND) U6.2(GND) U25.2(GND) U25.8(S) ; also sheet 1,2,3,4
IM: J4.2 T1.1(A:MX+) TP7.1
IMD_OK: D5.1(A) ; also sheet 1,2
IMD_OK_TEENSY: A1.D16(A2) R14.2 R15.1
IP: J4.1 T1.3(A:MX-) TP6.1
MHS: D12.1(A) ; also sheet 1
MHS_TEENSY: A1.D14(A0) R51.2 R52.1
N$13: RN1.8 U5.4(CLK)
N$15: R70.1 RN1.7 U5.3(SDO)
N$18: RN1.6 U5.2(SDI)
N$19: A1.D10((CS)D10) RN1.4
N$21: A1.D11((SDO)D11) RN1.3
N$25: A1.D0((CRX1)D0) A1.D4 U25.4(RXD)
N$29: A1.D1((CTX1)D1) A1.D3 U25.1(TXD)
N$31: D7.2(C) R23.1
N$32: D5.2(C) R14.1
N$33: D8.2(C) R39.1
N$34: D9.2(C) R44.1
N$35: R53.2 T1.10(A:TD-) U5.11(IP)
N$36: R47.1 U5.16(IBIAS)
N$37: R47.2 R50.1 U5.15(ICMP)
N$38: R83.1 T1.12(A:TD+) U5.10(IM)
N$39: C33.1 T1.11(A:TCT)
N$40: D12.2(C) R51.1
N$42: C34.1 R53.1 R83.2
N$43: A1.D12((SDI)D12) RN1.2
N$44: A1.D13((CLK)D13) RN1.1
N$47: D10.2(A) R75.1
N$59: D14.2(A) R76.1
PACK+_FILTERED: A1.D17(A3) ; also sheet 4
PRECHARGE_OK: D7.1(A) ; also sheet 1,3
PRECHARGE_OK_TEENSY: A1.D15(A1) R23.2 R30.1
TEENSY_OK: A1.D6 C36.1 R59.2 R76.2 U6.3(!MR!)
TS+_OUT_FILTERED: A1.D18(A4) ; also sheet 4
WATCHDOG_INPUT: A1.D5 R12.2 R75.2 U6.4(WDI) WATCHDOG_OK.1
Unconnected: A1.D2 A1.D7 A1.D8 A1.D9 A1.D23(A9) T1.2(A:MCT) T1.4(B:MX+) T1.5(B:MCT) T1.6(B:MX-) T1.7(B:TD-) T1.8(B:TCT) T1.9(B:TD+)

### Notes on the sheet
- LTC6820 and Transformer
- Voltage Dividers
- 12V to 3.3V
- Watchdog Timer
- 12V to 3.3V
- 12V to 3.3V
- 5V to 3.3V
- 10V to 3.3V
- Josh Kirshenbaum

## Library data of the parts
3.3V AMS_OK = HyTechDevices - Copy:LED_?_*: LED Blue <https://www.mouser.com/datasheet/2/216/APT1608VBC_D-246010.pdf> Green <https://www.mouser.com/datasheet/2/216/APT1608ZGCK-1173388.pdf> Orange <https://www.mouser.com/datasheet/2/216/APT1608SECK-6197.pdf> Red <https://www.mouser.com/datasheet/2/216/APT1608SECK-J3-PRV-1173336.pdf> White <https://www.mouser.com/datasheet/2/50/SM0603UWC-880813.pdf> Yellow <https://www.mouser.com/datasheet/2/216/APT1608SYCK-J3-PRV-1173311.pdf>; COLOR: Green; DKPN: 754-1790-1-ND; MANUFACTURER: Kingbright; MOPN: 604-APT1608ZGCK; MPN: APT1608ZGCK
5V = HyTechDevices - Copy:LED_?_*: LED Blue <https://www.mouser.com/datasheet/2/216/APT1608VBC_D-246010.pdf> Green <https://www.mouser.com/datasheet/2/216/APT1608ZGCK-1173388.pdf> Orange <https://www.mouser.com/datasheet/2/216/APT1608SECK-6197.pdf> Red <https://www.mouser.com/datasheet/2/216/APT1608SECK-J3-PRV-1173336.pdf> White <https://www.mouser.com/datasheet/2/50/SM0603UWC-880813.pdf> Yellow <https://www.mouser.com/datasheet/2/216/APT1608SYCK-J3-PRV-1173311.pdf>; COLOR: Blue; DKPN: 754-1789-1-ND; MANUFACTURER: Kingbright; MOPN: 604-APT1608VBC/D; MPN: APT1608VBC/D
12V = HyTechDevices - Copy:LED_?_*: LED Blue <https://www.mouser.com/datasheet/2/216/APT1608VBC_D-246010.pdf> Green <https://www.mouser.com/datasheet/2/216/APT1608ZGCK-1173388.pdf> Orange <https://www.mouser.com/datasheet/2/216/APT1608SECK-6197.pdf> Red <https://www.mouser.com/datasheet/2/216/APT1608SECK-J3-PRV-1173336.pdf> White <https://www.mouser.com/datasheet/2/50/SM0603UWC-880813.pdf> Yellow <https://www.mouser.com/datasheet/2/216/APT1608SYCK-J3-PRV-1173311.pdf>; COLOR: Red; DKPN: 754-1786-1-ND; MANUFACTURER: Kingbright; MOPN: 604-APT1608SECKJ3PRV; MPN: APT1608SECK/J3-PRV
A1 = HyTechDevices:TEENSY_4.0: Teensy 4.0 Datasheet <https://www.pjrc.com/store/teensy40.html>
A2 = HyTechDevices - Copy:VOLTAGE_REGULATOR_MODULE_?_*: Voltage Regulator Modules OKI-78SR Datasheet <https://www.mouser.com/datasheet/2/281/oki-78sr-56393.pdf>; DKPN: 811-2196-5-ND; MANUFACTURER: Murata Power Solutions Inc.; MOPN: 580-OKI78SR5/1.5W36C; MPN: OKI-78SR-5/1.5-W36-C
BSPD_CURRENT CURRENT_REF CURRENT_SENSE PACK+_OUT_TEST TP6 TP7 TP_3.3V TP_5V TP_12V TP_AMS_OK TP_GND TP_IMD_OK TP_TSAL_GREEN TP_TSAL_RED TS+_OUT_TEST WATCHDOG_OK = HyTechDevices - Copy:TEST_POINT: Test Point; DKPN: 36-5015CT-ND; MANUFACTURER: Keystone Electronics; MOPN: 534-5015; MPN: 5015
C1 C2 = HyTechDevices:CAPACITOR_?_*: Capacitor, Non-Polarized VJ...1BC Series Datasheet <https://www.mouser.com/datasheet/2/427/vjw1bcbascomseries-1762447.pdf> Samsung Datasheet <https://www.mouser.com/datasheet/2/585/MLCC-1837944.pdf> Walsin Datasheet <https://www.mouser.com/datasheet/2/210/WTC_MLCC_General_Purpose-1534899.pdf> GRM188R61A226ME15D <https://www.mouser.com/datasheet/2/281/1/GRM188R61A226ME15_02A-1985787.pdf> GRM188R61E106MA73D <https://www.mouser.com/datasheet/2/281/1/GRM188R61E106MA73_01A-1985806.pdf> 885012006013 <https://www.mouser.com/datasheet/2/445/885012006013-1726946.pdf> 2220Y6300105KXTWS2 <https://www.mouser.com/datasheet/2/218/SMD_High_and_Std_StackiCap_P62-1825512.pdf> Yageo Class 2, X5R <https://www.mouser.com/datasheet/2/447/UPY_GPHC_X5R_4V_to_50V_26-1827097.pdf> TDK C Series <https://www.mouser.com/ProductDetail/TDK/C3216X5R1V226M160AC?qs=%2Fha2pyFadujbcx9jh7lYl%2F4NeMoXFhdc8AqVWNq4wW6M2y7zl6GzBuhgtI0ngznN> AVX Automotive MLCC <https://www.mouser.com/datasheet/2/40/AutoMLCC-777028.pdf> KEMET X7R Series <https://www.mouser.com/datasheet/2/212/KEM_C1002_X7R_SMD-1102033.pdf>; CAPACITANCE: 10µF; DKPN: 490-7202-1-ND; MANUFACTURER: Murata Electronics; MOPN: 81-GRM188R61E106MA3D; MPN: GRM188R61E106MA73D; TOLERANCE: 20%; VOLTAGE: 25V
C3 = HyTechDevices:CAPACITOR_?_*: Capacitor, Non-Polarized VJ...1BC Series Datasheet <https://www.mouser.com/datasheet/2/427/vjw1bcbascomseries-1762447.pdf> Samsung Datasheet <https://www.mouser.com/datasheet/2/585/MLCC-1837944.pdf> Walsin Datasheet <https://www.mouser.com/datasheet/2/210/WTC_MLCC_General_Purpose-1534899.pdf> GRM188R61A226ME15D <https://www.mouser.com/datasheet/2/281/1/GRM188R61A226ME15_02A-1985787.pdf> GRM188R61E106MA73D <https://www.mouser.com/datasheet/2/281/1/GRM188R61E106MA73_01A-1985806.pdf> 885012006013 <https://www.mouser.com/datasheet/2/445/885012006013-1726946.pdf> 2220Y6300105KXTWS2 <https://www.mouser.com/datasheet/2/218/SMD_High_and_Std_StackiCap_P62-1825512.pdf> Yageo Class 2, X5R <https://www.mouser.com/datasheet/2/447/UPY_GPHC_X5R_4V_to_50V_26-1827097.pdf> TDK C Series <https://www.mouser.com/ProductDetail/TDK/C3216X5R1V226M160AC?qs=%2Fha2pyFadujbcx9jh7lYl%2F4NeMoXFhdc8AqVWNq4wW6M2y7zl6GzBuhgtI0ngznN> AVX Automotive MLCC <https://www.mouser.com/datasheet/2/40/AutoMLCC-777028.pdf> KEMET X7R Series <https://www.mouser.com/datasheet/2/212/KEM_C1002_X7R_SMD-1102033.pdf>; CAPACITANCE: 1µF; DKPN: 1276-1184-1-ND; MANUFACTURER: Samsung Electro-Mechanics; MOPN: 187-CL10B105KA8NNNC; MPN: CL10B105KA8NNNC; TOLERANCE: 10%; VOLTAGE: 25V
C4 C33 = HyTechDevices - Copy:CAPACITOR_?_*: Capacitor, Non-Polarized VJ...1BC Series Datasheet <https://www.mouser.com/datasheet/2/427/vjw1bcbascomseries-1762447.pdf> Samsung Datasheet <https://www.mouser.com/datasheet/2/585/MLCC-1837944.pdf> Walsin Datasheet <https://www.mouser.com/datasheet/2/210/WTC_MLCC_General_Purpose-1534899.pdf> GRM188R61A226ME15D <https://www.mouser.com/datasheet/2/281/1/GRM188R61A226ME15_02A-1985787.pdf> GRM188R61E106MA73D <https://www.mouser.com/datasheet/2/281/1/GRM188R61E106MA73_01A-1985806.pdf> 885012006013 <https://www.mouser.com/datasheet/2/445/885012006013-1726946.pdf> 2220Y6300105KXTWS2 <https://www.mouser.com/datasheet/2/218/SMD_High_and_Std_StackiCap_P62-1825512.pdf> Yageo Class 2, X5R <https://www.mouser.com/datasheet/2/447/UPY_GPHC_X5R_4V_to_50V_26-1827097.pdf> TDK C Series <https://www.mouser.com/ProductDetail/TDK/C3216X5R1V226M160AC?qs=%2Fha2pyFadujbcx9jh7lYl%2F4NeMoXFhdc8AqVWNq4wW6M2y7zl6GzBuhgtI0ngznN> AVX Automotive MLCC <https://www.mouser.com/datasheet/2/40/AutoMLCC-777028.pdf> KEMET X7R Series <https://www.mouser.com/datasheet/2/212/KEM_C1002_X7R_SMD-1102033.pdf>; CAPACITANCE: 10nF; DKPN: 311-4054-1-ND; MANUFACTURER: Yageo; MOPN: 603-CC603KRX7R6BB103; MPN: CC0603KRX7R6BB103; TOLERANCE: 10%; VOLTAGE: 10V
C5 C10 = HyTechDevices - Copy:CAPACITOR_?_*: Capacitor, Non-Polarized VJ...1BC Series Datasheet <https://www.mouser.com/datasheet/2/427/vjw1bcbascomseries-1762447.pdf> Samsung Datasheet <https://www.mouser.com/datasheet/2/585/MLCC-1837944.pdf> Walsin Datasheet <https://www.mouser.com/datasheet/2/210/WTC_MLCC_General_Purpose-1534899.pdf> GRM188R61A226ME15D <https://www.mouser.com/datasheet/2/281/1/GRM188R61A226ME15_02A-1985787.pdf> GRM188R61E106MA73D <https://www.mouser.com/datasheet/2/281/1/GRM188R61E106MA73_01A-1985806.pdf> 885012006013 <https://www.mouser.com/datasheet/2/445/885012006013-1726946.pdf> 2220Y6300105KXTWS2 <https://www.mouser.com/datasheet/2/218/SMD_High_and_Std_StackiCap_P62-1825512.pdf> Yageo Class 2, X5R <https://www.mouser.com/datasheet/2/447/UPY_GPHC_X5R_4V_to_50V_26-1827097.pdf> TDK C Series <https://www.mouser.com/ProductDetail/TDK/C3216X5R1V226M160AC?qs=%2Fha2pyFadujbcx9jh7lYl%2F4NeMoXFhdc8AqVWNq4wW6M2y7zl6GzBuhgtI0ngznN> AVX Automotive MLCC <https://www.mouser.com/datasheet/2/40/AutoMLCC-777028.pdf> KEMET X7R Series <https://www.mouser.com/datasheet/2/212/KEM_C1002_X7R_SMD-1102033.pdf>; CAPACITANCE: 4.7µF; DKPN: 1276-1044-1-ND; MANUFACTURER: Samsung Electro-Mechanics; MOPN: 187-CL10A475KP8NNNC; MPN: CL10A475KP8NNNC; TOLERANCE: 10%; VOLTAGE: 10V
C6 = HyTechDevices - Copy:CAPACITOR_?_*: Capacitor, Non-Polarized VJ...1BC Series Datasheet <https://www.mouser.com/datasheet/2/427/vjw1bcbascomseries-1762447.pdf> Samsung Datasheet <https://www.mouser.com/datasheet/2/585/MLCC-1837944.pdf> Walsin Datasheet <https://www.mouser.com/datasheet/2/210/WTC_MLCC_General_Purpose-1534899.pdf> GRM188R61A226ME15D <https://www.mouser.com/datasheet/2/281/1/GRM188R61A226ME15_02A-1985787.pdf> GRM188R61E106MA73D <https://www.mouser.com/datasheet/2/281/1/GRM188R61E106MA73_01A-1985806.pdf> 885012006013 <https://www.mouser.com/datasheet/2/445/885012006013-1726946.pdf> 2220Y6300105KXTWS2 <https://www.mouser.com/datasheet/2/218/SMD_High_and_Std_StackiCap_P62-1825512.pdf> Yageo Class 2, X5R <https://www.mouser.com/datasheet/2/447/UPY_GPHC_X5R_4V_to_50V_26-1827097.pdf> TDK C Series <https://www.mouser.com/ProductDetail/TDK/C3216X5R1V226M160AC?qs=%2Fha2pyFadujbcx9jh7lYl%2F4NeMoXFhdc8AqVWNq4wW6M2y7zl6GzBuhgtI0ngznN> AVX Automotive MLCC <https://www.mouser.com/datasheet/2/40/AutoMLCC-777028.pdf> KEMET X7R Series <https://www.mouser.com/datasheet/2/212/KEM_C1002_X7R_SMD-1102033.pdf>; CAPACITANCE: 1µF; DKPN: 1276-1184-1-ND; MANUFACTURER: Samsung Electro-Mechanics; MOPN: 187-CL10B105KA8NNNC; MPN: CL10B105KA8NNNC; TOLERANCE: 10%; VOLTAGE: 25V
C7 = HyTechDevices - Copy:CAPACITOR_?_*: Capacitor, Non-Polarized VJ...1BC Series Datasheet <https://www.mouser.com/datasheet/2/427/vjw1bcbascomseries-1762447.pdf> Samsung Datasheet <https://www.mouser.com/datasheet/2/585/MLCC-1837944.pdf> Walsin Datasheet <https://www.mouser.com/datasheet/2/210/WTC_MLCC_General_Purpose-1534899.pdf> GRM188R61A226ME15D <https://www.mouser.com/datasheet/2/281/1/GRM188R61A226ME15_02A-1985787.pdf> GRM188R61E106MA73D <https://www.mouser.com/datasheet/2/281/1/GRM188R61E106MA73_01A-1985806.pdf> 885012006013 <https://www.mouser.com/datasheet/2/445/885012006013-1726946.pdf> 2220Y6300105KXTWS2 <https://www.mouser.com/datasheet/2/218/SMD_High_and_Std_StackiCap_P62-1825512.pdf> Yageo Class 2, X5R <https://www.mouser.com/datasheet/2/447/UPY_GPHC_X5R_4V_to_50V_26-1827097.pdf> TDK C Series <https://www.mouser.com/ProductDetail/TDK/C3216X5R1V226M160AC?qs=%2Fha2pyFadujbcx9jh7lYl%2F4NeMoXFhdc8AqVWNq4wW6M2y7zl6GzBuhgtI0ngznN> AVX Automotive MLCC <https://www.mouser.com/datasheet/2/40/AutoMLCC-777028.pdf> KEMET X7R Series <https://www.mouser.com/datasheet/2/212/KEM_C1002_X7R_SMD-1102033.pdf>; CAPACITANCE: 0.1µF; DKPN: 1276-1006-1-ND; MANUFACTURER: Samsung Electro-Mechanics; MOPN: 187-CL10B104KA8NNNC; MPN: CL10B104KA8NNNC; TOLERANCE: 10%; VOLTAGE: 25V
C8 C28 C37 C46 C50 = HyTechDevices:CAPACITOR_?_*: Capacitor, Non-Polarized VJ...1BC Series Datasheet <https://www.mouser.com/datasheet/2/427/vjw1bcbascomseries-1762447.pdf> Samsung Datasheet <https://www.mouser.com/datasheet/2/585/MLCC-1837944.pdf> Walsin Datasheet <https://www.mouser.com/datasheet/2/210/WTC_MLCC_General_Purpose-1534899.pdf> GRM188R61A226ME15D <https://www.mouser.com/datasheet/2/281/1/GRM188R61A226ME15_02A-1985787.pdf> GRM188R61E106MA73D <https://www.mouser.com/datasheet/2/281/1/GRM188R61E106MA73_01A-1985806.pdf> 885012006013 <https://www.mouser.com/datasheet/2/445/885012006013-1726946.pdf> 2220Y6300105KXTWS2 <https://www.mouser.com/datasheet/2/218/SMD_High_and_Std_StackiCap_P62-1825512.pdf> Yageo Class 2, X5R <https://www.mouser.com/datasheet/2/447/UPY_GPHC_X5R_4V_to_50V_26-1827097.pdf> TDK C Series <https://www.mouser.com/ProductDetail/TDK/C3216X5R1V226M160AC?qs=%2Fha2pyFadujbcx9jh7lYl%2F4NeMoXFhdc8AqVWNq4wW6M2y7zl6GzBuhgtI0ngznN> AVX Automotive MLCC <https://www.mouser.com/datasheet/2/40/AutoMLCC-777028.pdf> KEMET X7R Series <https://www.mouser.com/datasheet/2/212/KEM_C1002_X7R_SMD-1102033.pdf>; CAPACITANCE: 0.1µF; DKPN: 1276-1006-1-ND; MANUFACTURER: Samsung Electro-Mechanics; MOPN: 187-CL10B104KA8NNNC; MPN: CL10B104KA8NNNC; TOLERANCE: 10%; VOLTAGE: 25V
C9 = HyTechDevices - Copy:CAPACITOR_?_*: Capacitor, Non-Polarized VJ...1BC Series Datasheet <https://www.mouser.com/datasheet/2/427/vjw1bcbascomseries-1762447.pdf> Samsung Datasheet <https://www.mouser.com/datasheet/2/585/MLCC-1837944.pdf> Walsin Datasheet <https://www.mouser.com/datasheet/2/210/WTC_MLCC_General_Purpose-1534899.pdf> GRM188R61A226ME15D <https://www.mouser.com/datasheet/2/281/1/GRM188R61A226ME15_02A-1985787.pdf> GRM188R61E106MA73D <https://www.mouser.com/datasheet/2/281/1/GRM188R61E106MA73_01A-1985806.pdf> 885012006013 <https://www.mouser.com/datasheet/2/445/885012006013-1726946.pdf> 2220Y6300105KXTWS2 <https://www.mouser.com/datasheet/2/218/SMD_High_and_Std_StackiCap_P62-1825512.pdf> Yageo Class 2, X5R <https://www.mouser.com/datasheet/2/447/UPY_GPHC_X5R_4V_to_50V_26-1827097.pdf> TDK C Series <https://www.mouser.com/ProductDetail/TDK/C3216X5R1V226M160AC?qs=%2Fha2pyFadujbcx9jh7lYl%2F4NeMoXFhdc8AqVWNq4wW6M2y7zl6GzBuhgtI0ngznN> AVX Automotive MLCC <https://www.mouser.com/datasheet/2/40/AutoMLCC-777028.pdf> KEMET X7R Series <https://www.mouser.com/datasheet/2/212/KEM_C1002_X7R_SMD-1102033.pdf>; CAPACITANCE: 1µF; DKPN: 311-1796-1-ND; MANUFACTURER: Yageo; MOPN: 603-CC603KRX7R6BB105; MPN: CC0603KRX7R6BB105; TOLERANCE: 10%; VOLTAGE: 10V
C11-C13 C16 C20 C22-C27 C31 = HyTechDevices:CAPACITOR_?_*: Capacitor, Non-Polarized VJ...1BC Series Datasheet <https://www.mouser.com/datasheet/2/427/vjw1bcbascomseries-1762447.pdf> Samsung Datasheet <https://www.mouser.com/datasheet/2/585/MLCC-1837944.pdf> Walsin Datasheet <https://www.mouser.com/datasheet/2/210/WTC_MLCC_General_Purpose-1534899.pdf> GRM188R61A226ME15D <https://www.mouser.com/datasheet/2/281/1/GRM188R61A226ME15_02A-1985787.pdf> GRM188R61E106MA73D <https://www.mouser.com/datasheet/2/281/1/GRM188R61E106MA73_01A-1985806.pdf> 885012006013 <https://www.mouser.com/datasheet/2/445/885012006013-1726946.pdf> 2220Y6300105KXTWS2 <https://www.mouser.com/datasheet/2/218/SMD_High_and_Std_StackiCap_P62-1825512.pdf> Yageo Class 2, X5R <https://www.mouser.com/datasheet/2/447/UPY_GPHC_X5R_4V_to_50V_26-1827097.pdf> TDK C Series <https://www.mouser.com/ProductDetail/TDK/C3216X5R1V226M160AC?qs=%2Fha2pyFadujbcx9jh7lYl%2F4NeMoXFhdc8AqVWNq4wW6M2y7zl6GzBuhgtI0ngznN> AVX Automotive MLCC <https://www.mouser.com/datasheet/2/40/AutoMLCC-777028.pdf> KEMET X7R Series <https://www.mouser.com/datasheet/2/212/KEM_C1002_X7R_SMD-1102033.pdf>; CAPACITANCE: 0.1µF; DKPN: 720-1688-1-ND; MANUFACTURER: Vishay Vitramon; MOPN: 77-VJ0603Y104JXQPBC; MPN: VJ0603Y104JXQPW1BC; TOLERANCE: 5%; VOLTAGE: 10V
C14 C15 C29 C30 C35 C36 C39 C40 C47 C48 C51 C52 = HyTechDevices - Copy:CAPACITOR_?_*: Capacitor, Non-Polarized VJ...1BC Series Datasheet <https://www.mouser.com/datasheet/2/427/vjw1bcbascomseries-1762447.pdf> Samsung Datasheet <https://www.mouser.com/datasheet/2/585/MLCC-1837944.pdf> Walsin Datasheet <https://www.mouser.com/datasheet/2/210/WTC_MLCC_General_Purpose-1534899.pdf> GRM188R61A226ME15D <https://www.mouser.com/datasheet/2/281/1/GRM188R61A226ME15_02A-1985787.pdf> GRM188R61E106MA73D <https://www.mouser.com/datasheet/2/281/1/GRM188R61E106MA73_01A-1985806.pdf> 885012006013 <https://www.mouser.com/datasheet/2/445/885012006013-1726946.pdf> 2220Y6300105KXTWS2 <https://www.mouser.com/datasheet/2/218/SMD_High_and_Std_StackiCap_P62-1825512.pdf> Yageo Class 2, X5R <https://www.mouser.com/datasheet/2/447/UPY_GPHC_X5R_4V_to_50V_26-1827097.pdf> TDK C Series <https://www.mouser.com/ProductDetail/TDK/C3216X5R1V226M160AC?qs=%2Fha2pyFadujbcx9jh7lYl%2F4NeMoXFhdc8AqVWNq4wW6M2y7zl6GzBuhgtI0ngznN> AVX Automotive MLCC <https://www.mouser.com/datasheet/2/40/AutoMLCC-777028.pdf> KEMET X7R Series <https://www.mouser.com/datasheet/2/212/KEM_C1002_X7R_SMD-1102033.pdf>; CAPACITANCE: 0.1µF; DKPN: 720-1688-1-ND; MANUFACTURER: Vishay Vitramon; MOPN: 77-VJ0603Y104JXQPBC; MPN: VJ0603Y104JXQPW1BC; TOLERANCE: 5%; VOLTAGE: 10V
C32 = HyTechDevices:CAPACITOR_?_*: Capacitor, Non-Polarized VJ...1BC Series Datasheet <https://www.mouser.com/datasheet/2/427/vjw1bcbascomseries-1762447.pdf> Samsung Datasheet <https://www.mouser.com/datasheet/2/585/MLCC-1837944.pdf> Walsin Datasheet <https://www.mouser.com/datasheet/2/210/WTC_MLCC_General_Purpose-1534899.pdf> GRM188R61A226ME15D <https://www.mouser.com/datasheet/2/281/1/GRM188R61A226ME15_02A-1985787.pdf> GRM188R61E106MA73D <https://www.mouser.com/datasheet/2/281/1/GRM188R61E106MA73_01A-1985806.pdf> 885012006013 <https://www.mouser.com/datasheet/2/445/885012006013-1726946.pdf> 2220Y6300105KXTWS2 <https://www.mouser.com/datasheet/2/218/SMD_High_and_Std_StackiCap_P62-1825512.pdf> Yageo Class 2, X5R <https://www.mouser.com/datasheet/2/447/UPY_GPHC_X5R_4V_to_50V_26-1827097.pdf> TDK C Series <https://www.mouser.com/ProductDetail/TDK/C3216X5R1V226M160AC?qs=%2Fha2pyFadujbcx9jh7lYl%2F4NeMoXFhdc8AqVWNq4wW6M2y7zl6GzBuhgtI0ngznN> AVX Automotive MLCC <https://www.mouser.com/datasheet/2/40/AutoMLCC-777028.pdf> KEMET X7R Series <https://www.mouser.com/datasheet/2/212/KEM_C1002_X7R_SMD-1102033.pdf>; CAPACITANCE: 1µF; DKPN: 311-1796-1-ND; MANUFACTURER: Yageo; MOPN: 603-CC603KRX7R6BB105; MPN: CC0603KRX7R6BB105; TOLERANCE: 10%; VOLTAGE: 10V
C34 = HyTechDevices - Copy:CAPACITOR_?_*: Capacitor, Non-Polarized VJ...1BC Series Datasheet <https://www.mouser.com/datasheet/2/427/vjw1bcbascomseries-1762447.pdf> Samsung Datasheet <https://www.mouser.com/datasheet/2/585/MLCC-1837944.pdf> Walsin Datasheet <https://www.mouser.com/datasheet/2/210/WTC_MLCC_General_Purpose-1534899.pdf> GRM188R61A226ME15D <https://www.mouser.com/datasheet/2/281/1/GRM188R61A226ME15_02A-1985787.pdf> GRM188R61E106MA73D <https://www.mouser.com/datasheet/2/281/1/GRM188R61E106MA73_01A-1985806.pdf> 885012006013 <https://www.mouser.com/datasheet/2/445/885012006013-1726946.pdf> 2220Y6300105KXTWS2 <https://www.mouser.com/datasheet/2/218/SMD_High_and_Std_StackiCap_P62-1825512.pdf> Yageo Class 2, X5R <https://www.mouser.com/datasheet/2/447/UPY_GPHC_X5R_4V_to_50V_26-1827097.pdf> TDK C Series <https://www.mouser.com/ProductDetail/TDK/C3216X5R1V226M160AC?qs=%2Fha2pyFadujbcx9jh7lYl%2F4NeMoXFhdc8AqVWNq4wW6M2y7zl6GzBuhgtI0ngznN> AVX Automotive MLCC <https://www.mouser.com/datasheet/2/40/AutoMLCC-777028.pdf> KEMET X7R Series <https://www.mouser.com/datasheet/2/212/KEM_C1002_X7R_SMD-1102033.pdf>; CAPACITANCE: 15pF; DKPN: 720-VJ0603A150FXQPW1BCCT-ND; MANUFACTURER: Vishay Vitramon; MOPN: 77-VJ0603A150FXQPBC; MPN: VJ0603A150FXQPW1BC; TOLERANCE: 1%; VOLTAGE: 10V
C43 C45 C49 C53 = HyTechDevices - Copy:CAPACITOR_?_*: Capacitor, Non-Polarized VJ...1BC Series Datasheet <https://www.mouser.com/datasheet/2/427/vjw1bcbascomseries-1762447.pdf> Samsung Datasheet <https://www.mouser.com/datasheet/2/585/MLCC-1837944.pdf> Walsin Datasheet <https://www.mouser.com/datasheet/2/210/WTC_MLCC_General_Purpose-1534899.pdf> GRM188R61A226ME15D <https://www.mouser.com/datasheet/2/281/1/GRM188R61A226ME15_02A-1985787.pdf> GRM188R61E106MA73D <https://www.mouser.com/datasheet/2/281/1/GRM188R61E106MA73_01A-1985806.pdf> 885012006013 <https://www.mouser.com/datasheet/2/445/885012006013-1726946.pdf> 2220Y6300105KXTWS2 <https://www.mouser.com/datasheet/2/218/SMD_High_and_Std_StackiCap_P62-1825512.pdf> Yageo Class 2, X5R <https://www.mouser.com/datasheet/2/447/UPY_GPHC_X5R_4V_to_50V_26-1827097.pdf> TDK C Series <https://www.mouser.com/ProductDetail/TDK/C3216X5R1V226M160AC?qs=%2Fha2pyFadujbcx9jh7lYl%2F4NeMoXFhdc8AqVWNq4wW6M2y7zl6GzBuhgtI0ngznN> AVX Automotive MLCC <https://www.mouser.com/datasheet/2/40/AutoMLCC-777028.pdf> KEMET X7R Series <https://www.mouser.com/datasheet/2/212/KEM_C1002_X7R_SMD-1102033.pdf>; CAPACITANCE: 680pF; DKPN: 732-7757-1-ND; MANUFACTURER: Würth Elektronik; MOPN: 710-885012006013; MPN: 885012006013; TOLERANCE: 5%; VOLTAGE: 10V
D1 = HyTechDevices:TVS_*: TVS Diode GSOT Datasheet <https://www.mouser.com/datasheet/2/427/gsot03-1767593.pdf>; DKPN: GSOT15-E3-08CT-ND; MANUFACTURER: Vishay General Semiconductor - Diodes Division; MOPN: 78-GSOT15-E3-08; MPN: GSOT15-E3-08; VOLTAGE: 15V
D2 D10 = HyTechDevices:LED_?_*: LED Blue <https://www.mouser.com/datasheet/2/216/APT1608VBC_D-246010.pdf> Green <https://www.mouser.com/datasheet/2/216/APT1608ZGCK-1173388.pdf> Orange <https://www.mouser.com/datasheet/2/216/APT1608SECK-6197.pdf> Red <https://www.mouser.com/datasheet/2/216/APT1608SECK-J3-PRV-1173336.pdf> White <https://www.mouser.com/datasheet/2/50/SM0603UWC-880813.pdf> Yellow <https://www.mouser.com/datasheet/2/216/APT1608SYCK-J3-PRV-1173311.pdf>; COLOR: Green; DKPN: 754-1790-1-ND; MANUFACTURER: Kingbright; MOPN: 604-APT1608ZGCK; MPN: APT1608ZGCK
D3 D6 D14 = HyTechDevices:LED_?_*: LED Blue <https://www.mouser.com/datasheet/2/216/APT1608VBC_D-246010.pdf> Green <https://www.mouser.com/datasheet/2/216/APT1608ZGCK-1173388.pdf> Orange <https://www.mouser.com/datasheet/2/216/APT1608SECK-6197.pdf> Red <https://www.mouser.com/datasheet/2/216/APT1608SECK-J3-PRV-1173336.pdf> White <https://www.mouser.com/datasheet/2/50/SM0603UWC-880813.pdf> Yellow <https://www.mouser.com/datasheet/2/216/APT1608SYCK-J3-PRV-1173311.pdf>; COLOR: Red; DKPN: 754-1786-1-ND; MANUFACTURER: Kingbright; MOPN: 604-APT1608SECKJ3PRV; MPN: APT1608SECK/J3-PRV
D4 D13 = HyTechDevices - Copy:TVS_*: TVS Diode GSOT Datasheet <https://www.mouser.com/datasheet/2/427/gsot03-1767593.pdf>; DKPN: GSOT08C-E3-08CT-ND; MANUFACTURER: Vishay General Semiconductor - Diodes Division; MOPN: 78-GSOT08C-E3-08; MPN: GSOT08C-E3-08; VOLTAGE: 8V
D5 D7-D9 D12 = HyTechDevices:SCHOTTKY: Schottky Rectifier Diode Datasheet <https://www.vishay.com/docs/85892/vsky20401608.pdf>; DKPN: 112-VSKY20401608-G4-08CT-ND; MANUFACTURER: Vishay General Semiconductor - Diodes Division; MOPN: 78-VSKY20401608G408; MPN: VSKY20401608-G4-08
D11 = HyTechDevices - Copy:LED_?_*: LED Blue <https://www.mouser.com/datasheet/2/216/APT1608VBC_D-246010.pdf> Green <https://www.mouser.com/datasheet/2/216/APT1608ZGCK-1173388.pdf> Orange <https://www.mouser.com/datasheet/2/216/APT1608SECK-6197.pdf> Red <https://www.mouser.com/datasheet/2/216/APT1608SECK-J3-PRV-1173336.pdf> White <https://www.mouser.com/datasheet/2/50/SM0603UWC-880813.pdf> Yellow <https://www.mouser.com/datasheet/2/216/APT1608SYCK-J3-PRV-1173311.pdf>; COLOR: Yellow; DKPN: 754-1788-1-ND; MANUFACTURER: Kingbright; MOPN: 604-APT1608SYCK/J3-PRV; MPN: APT1608SYCK/J3-PRV
F1 = HyTechDevices - Copy:FUSE_?_*: Fuse 0885 Series <https://www.mouser.com/datasheet/2/240/Littelfuse_Fuse_885_Datasheet_pdf-1371443.pdf>; CURRENT: 1A
IMD_OK = HyTechDevices - Copy:LED_?_*: LED Blue <https://www.mouser.com/datasheet/2/216/APT1608VBC_D-246010.pdf> Green <https://www.mouser.com/datasheet/2/216/APT1608ZGCK-1173388.pdf> Orange <https://www.mouser.com/datasheet/2/216/APT1608SECK-6197.pdf> Red <https://www.mouser.com/datasheet/2/216/APT1608SECK-J3-PRV-1173336.pdf> White <https://www.mouser.com/datasheet/2/50/SM0603UWC-880813.pdf> Yellow <https://www.mouser.com/datasheet/2/216/APT1608SYCK-J3-PRV-1173311.pdf>; COLOR: Orange; DKPN: 754-1120-1-ND; MANUFACTURER: Kingbright; MOPN: 604-APT1608SECK; MPN: APT1608SECK
J1 = HyTechDevices - Copy:CONNECTOR-CAN_?_*: HyTech CAN Connector; MANUFACTURER: Molex; MPN: 430450414
J2 J3 = HyTechDevices - Copy:CONNECTOR-8_?_*: 8 Pin Connector; MANUFACTURER: MOLEX; MPN: 430450814
J4 = HyTechDevices - Copy:CONNECTOR-2_?_*: 2 Pin Connector; MANUFACTURER: MOLEX; MPN: 436500217
J5 = HyTechDevices - Copy:CONNECTOR-12_?_*: 12 pin connector; MANUFACTURER: MOLEX; MPN: 430451214
J6 = HyTechDevices - Copy:CONNECTOR-14_?_*: 14 pin connector; MANUFACTURER: MOLEX; MPN: 430451414
Q1 Q2 = HyTechDevices:TRANSISTOR_N_MOS_?_*: N-MOSFET PMV15ENEA Datasheet <https://www.mouser.com/datasheet/2/916/PMV15ENEA-1604828.pdf> TK6P65W Datasheet <https://www.mouser.com/datasheet/2/408/TK6P65W_datasheet_en_20151225-1916290.pdf> SIR638ADP Datasheet <https://www.mouser.com/datasheet/2/427/sir638adp-1766131.pdf>; DKPN: 1727-8588-1-ND; MANUFACTURER: Nexperia USA Inc.; MOPN: 771-PMV15ENEAR; MPN: PMV15ENEAR
R1 R3 R7 R8 R31 = HyTechDevices:RESISTOR_?_*: Resistor PWR163 Series <https://www.mouser.com/datasheet/2/54/pwr163-777985.pdf> AC Series <https://www.mouser.com/datasheet/2/447/Yageo_PYu_AC_51_RoHS_L_7_1714230-1874691.pdf> PU Series <https://www.mouser.com/datasheet/2/447/PYu-PU_51_RoHS_L_6-1504619.pdf> ERA Series <https://www.mouser.com/datasheet/2/315/AOA0000C307-1149632.pdf> PWR263 Series <https://www.mouser.com/datasheet/2/54/pwr263s_35-778069.pdf> RC Series <https://www.mouser.com/datasheet/2/447/Yageo_03_18_2021_PYu_RC_Group_51_RoHS_L_11-2199992.pdf> ERJ PB3, PB6 Series <https://www.mouser.com/datasheet/2/315/AOA0000C328-1530132.pdf> ERJ PA2, P03, PA3, P06, P08, P14 Series <https://www.mouser.com/datasheet/2/315/AOA0000C331-1141874.pdf>; DKPN: 311-1.00KHRCT-ND; MANUFACTURER: Yageo; MOPN: 603-RC0603FR-071KL; MPN: RC0603FR-071KL; POWER: 0.1W; RESISTANCE: 1k; TOLERANCE: 1%; VOLTAGE_CONTINUOUS: 10.00V; VOLTAGE_MAX: 75V
R2 R56 R72-R74 = HyTechDevices:RESISTOR_?_*: Resistor PWR163 Series <https://www.mouser.com/datasheet/2/54/pwr163-777985.pdf> AC Series <https://www.mouser.com/datasheet/2/447/Yageo_PYu_AC_51_RoHS_L_7_1714230-1874691.pdf> PU Series <https://www.mouser.com/datasheet/2/447/PYu-PU_51_RoHS_L_6-1504619.pdf> ERA Series <https://www.mouser.com/datasheet/2/315/AOA0000C307-1149632.pdf> PWR263 Series <https://www.mouser.com/datasheet/2/54/pwr263s_35-778069.pdf> RC Series <https://www.mouser.com/datasheet/2/447/Yageo_03_18_2021_PYu_RC_Group_51_RoHS_L_11-2199992.pdf> ERJ PB3, PB6 Series <https://www.mouser.com/datasheet/2/315/AOA0000C328-1530132.pdf> ERJ PA2, P03, PA3, P06, P08, P14 Series <https://www.mouser.com/datasheet/2/315/AOA0000C331-1141874.pdf>; DKPN: P2.0KBDCT-ND; MANUFACTURER: Panasonic Electronic Components; MOPN: 667-ERA-3ARB202V; MPN: ERA-3ARB202V; POWER: 0.1W; RESISTANCE: 2k; TOLERANCE: 0.1%; VOLTAGE_CONTINUOUS: 14.14V; VOLTAGE_MAX: 75V
R4 R18 R22 R32 R40 = HyTechDevices:RESISTOR_?_*: Resistor PWR163 Series <https://www.mouser.com/datasheet/2/54/pwr163-777985.pdf> AC Series <https://www.mouser.com/datasheet/2/447/Yageo_PYu_AC_51_RoHS_L_7_1714230-1874691.pdf> PU Series <https://www.mouser.com/datasheet/2/447/PYu-PU_51_RoHS_L_6-1504619.pdf> ERA Series <https://www.mouser.com/datasheet/2/315/AOA0000C307-1149632.pdf> PWR263 Series <https://www.mouser.com/datasheet/2/54/pwr263s_35-778069.pdf> RC Series <https://www.mouser.com/datasheet/2/447/Yageo_03_18_2021_PYu_RC_Group_51_RoHS_L_11-2199992.pdf> ERJ PB3, PB6 Series <https://www.mouser.com/datasheet/2/315/AOA0000C328-1530132.pdf> ERJ PA2, P03, PA3, P06, P08, P14 Series <https://www.mouser.com/datasheet/2/315/AOA0000C331-1141874.pdf>; RESISTANCE: DNP
R5 R17 = HyTechDevices:RESISTOR_?_*: Resistor PWR163 Series <https://www.mouser.com/datasheet/2/54/pwr163-777985.pdf> AC Series <https://www.mouser.com/datasheet/2/447/Yageo_PYu_AC_51_RoHS_L_7_1714230-1874691.pdf> PU Series <https://www.mouser.com/datasheet/2/447/PYu-PU_51_RoHS_L_6-1504619.pdf> ERA Series <https://www.mouser.com/datasheet/2/315/AOA0000C307-1149632.pdf> PWR263 Series <https://www.mouser.com/datasheet/2/54/pwr263s_35-778069.pdf> RC Series <https://www.mouser.com/datasheet/2/447/Yageo_03_18_2021_PYu_RC_Group_51_RoHS_L_11-2199992.pdf> ERJ PB3, PB6 Series <https://www.mouser.com/datasheet/2/315/AOA0000C328-1530132.pdf> ERJ PA2, P03, PA3, P06, P08, P14 Series <https://www.mouser.com/datasheet/2/315/AOA0000C331-1141874.pdf>; DKPN: P4.12KDBCT-ND; MANUFACTURER: Panasonic Electronic Components; MOPN: 667-ERA-3AEB4121V; MPN: ERA-3AEB4121V; POWER: 0.1W; RESISTANCE: 4.12k; TOLERANCE: 0.1%; VOLTAGE_CONTINUOUS: 20.30V; VOLTAGE_MAX: 75V
R6 = HyTechDevices:RESISTOR_?_*: Resistor PWR163 Series <https://www.mouser.com/datasheet/2/54/pwr163-777985.pdf> AC Series <https://www.mouser.com/datasheet/2/447/Yageo_PYu_AC_51_RoHS_L_7_1714230-1874691.pdf> PU Series <https://www.mouser.com/datasheet/2/447/PYu-PU_51_RoHS_L_6-1504619.pdf> ERA Series <https://www.mouser.com/datasheet/2/315/AOA0000C307-1149632.pdf> PWR263 Series <https://www.mouser.com/datasheet/2/54/pwr263s_35-778069.pdf> RC Series <https://www.mouser.com/datasheet/2/447/Yageo_03_18_2021_PYu_RC_Group_51_RoHS_L_11-2199992.pdf> ERJ PB3, PB6 Series <https://www.mouser.com/datasheet/2/315/AOA0000C328-1530132.pdf> ERJ PA2, P03, PA3, P06, P08, P14 Series <https://www.mouser.com/datasheet/2/315/AOA0000C331-1141874.pdf>; DKPN: 311-43.0KHRCT-ND; MANUFACTURER: Yageo; MOPN: 603-RC0603FR-0743KL; MPN: RC0603FR-0743KL; POWER: 0.1W; RESISTANCE: 43k; TOLERANCE: 1%; VOLTAGE_CONTINUOUS: 65.57V; VOLTAGE_MAX: 75V
R9 R23 R55 R58 R60 R64 R66 R68 R70 R77-R82 R84-R87 = HyTechDevices - Copy:RESISTOR_?_*: Resistor PWR163 Series <https://www.mouser.com/datasheet/2/54/pwr163-777985.pdf> AC Series <https://www.mouser.com/datasheet/2/447/Yageo_PYu_AC_51_RoHS_L_7_1714230-1874691.pdf> PU Series <https://www.mouser.com/datasheet/2/447/PYu-PU_51_RoHS_L_6-1504619.pdf> ERA Series <https://www.mouser.com/datasheet/2/315/AOA0000C307-1149632.pdf> PWR263 Series <https://www.mouser.com/datasheet/2/54/pwr263s_35-778069.pdf> RC Series <https://www.mouser.com/datasheet/2/447/Yageo_03_18_2021_PYu_RC_Group_51_RoHS_L_11-2199992.pdf> ERJ PB3, PB6 Series <https://www.mouser.com/datasheet/2/315/AOA0000C328-1530132.pdf> ERJ PA2, P03, PA3, P06, P08, P14 Series <https://www.mouser.com/datasheet/2/315/AOA0000C331-1141874.pdf>; DKPN: 311-10.0KHRCT-ND; MANUFACTURER: Yageo; MOPN: 603-RC0603FR-0710KL; MPN: RC0603FR-0710KL; POWER: 0.1W; RESISTANCE: 10k; TOLERANCE: 1%; VOLTAGE_CONTINUOUS: 31.62V; VOLTAGE_MAX: 75V
R10 R47 R50 R59 = HyTechDevices - Copy:RESISTOR_?_*: Resistor PWR163 Series <https://www.mouser.com/datasheet/2/54/pwr163-777985.pdf> AC Series <https://www.mouser.com/datasheet/2/447/Yageo_PYu_AC_51_RoHS_L_7_1714230-1874691.pdf> PU Series <https://www.mouser.com/datasheet/2/447/PYu-PU_51_RoHS_L_6-1504619.pdf> ERA Series <https://www.mouser.com/datasheet/2/315/AOA0000C307-1149632.pdf> PWR263 Series <https://www.mouser.com/datasheet/2/54/pwr263s_35-778069.pdf> RC Series <https://www.mouser.com/datasheet/2/447/Yageo_03_18_2021_PYu_RC_Group_51_RoHS_L_11-2199992.pdf> ERJ PB3, PB6 Series <https://www.mouser.com/datasheet/2/315/AOA0000C328-1530132.pdf> ERJ PA2, P03, PA3, P06, P08, P14 Series <https://www.mouser.com/datasheet/2/315/AOA0000C331-1141874.pdf>; DKPN: 311-1.00KHRCT-ND; MANUFACTURER: Yageo; MOPN: 603-RC0603FR-071KL; MPN: RC0603FR-071KL; POWER: 0.1W; RESISTANCE: 1k; TOLERANCE: 1%; VOLTAGE_CONTINUOUS: 10.00V; VOLTAGE_MAX: 75V
R11 = HyTechDevices - Copy:RESISTOR_?_*: Resistor PWR163 Series <https://www.mouser.com/datasheet/2/54/pwr163-777985.pdf> AC Series <https://www.mouser.com/datasheet/2/447/Yageo_PYu_AC_51_RoHS_L_7_1714230-1874691.pdf> PU Series <https://www.mouser.com/datasheet/2/447/PYu-PU_51_RoHS_L_6-1504619.pdf> ERA Series <https://www.mouser.com/datasheet/2/315/AOA0000C307-1149632.pdf> PWR263 Series <https://www.mouser.com/datasheet/2/54/pwr263s_35-778069.pdf> RC Series <https://www.mouser.com/datasheet/2/447/Yageo_03_18_2021_PYu_RC_Group_51_RoHS_L_11-2199992.pdf> ERJ PB3, PB6 Series <https://www.mouser.com/datasheet/2/315/AOA0000C328-1530132.pdf> ERJ PA2, P03, PA3, P06, P08, P14 Series <https://www.mouser.com/datasheet/2/315/AOA0000C331-1141874.pdf>; DKPN: 311-2465-1-ND; MANUFACTURER: Yageo; MOPN: 603-RT0603DRE071K4L; MPN: RT0603DRE071K4L; POWER: 0.1W; RESISTANCE: 1.4K; TOLERANCE: 0.5%; VOLTAGE_CONTINUOUS: 75V; VOLTAGE_MAX: 75V
R12 R48 R54 R61 R62 = HyTechDevices:RESISTOR_?_*: Resistor PWR163 Series <https://www.mouser.com/datasheet/2/54/pwr163-777985.pdf> AC Series <https://www.mouser.com/datasheet/2/447/Yageo_PYu_AC_51_RoHS_L_7_1714230-1874691.pdf> PU Series <https://www.mouser.com/datasheet/2/447/PYu-PU_51_RoHS_L_6-1504619.pdf> ERA Series <https://www.mouser.com/datasheet/2/315/AOA0000C307-1149632.pdf> PWR263 Series <https://www.mouser.com/datasheet/2/54/pwr263s_35-778069.pdf> RC Series <https://www.mouser.com/datasheet/2/447/Yageo_03_18_2021_PYu_RC_Group_51_RoHS_L_11-2199992.pdf> ERJ PB3, PB6 Series <https://www.mouser.com/datasheet/2/315/AOA0000C328-1530132.pdf> ERJ PA2, P03, PA3, P06, P08, P14 Series <https://www.mouser.com/datasheet/2/315/AOA0000C331-1141874.pdf>; DKPN: 311-10.0KHRCT-ND; MANUFACTURER: Yageo; MOPN: 603-RC0603FR-0710KL; MPN: RC0603FR-0710KL; POWER: 0.1W; RESISTANCE: 10k; TOLERANCE: 1%; VOLTAGE_CONTINUOUS: 31.62V; VOLTAGE_MAX: 75V
R13 = HyTechDevices - Copy:RESISTOR_?_*: Resistor PWR163 Series <https://www.mouser.com/datasheet/2/54/pwr163-777985.pdf> AC Series <https://www.mouser.com/datasheet/2/447/Yageo_PYu_AC_51_RoHS_L_7_1714230-1874691.pdf> PU Series <https://www.mouser.com/datasheet/2/447/PYu-PU_51_RoHS_L_6-1504619.pdf> ERA Series <https://www.mouser.com/datasheet/2/315/AOA0000C307-1149632.pdf> PWR263 Series <https://www.mouser.com/datasheet/2/54/pwr263s_35-778069.pdf> RC Series <https://www.mouser.com/datasheet/2/447/Yageo_03_18_2021_PYu_RC_Group_51_RoHS_L_11-2199992.pdf> ERJ PB3, PB6 Series <https://www.mouser.com/datasheet/2/315/AOA0000C328-1530132.pdf> ERJ PA2, P03, PA3, P06, P08, P14 Series <https://www.mouser.com/datasheet/2/315/AOA0000C331-1141874.pdf>; DKPN: YAG2294CT-ND; MANUFACTURER: Yageo; MOPN: 603-RC0603JR-10100KL; MPN: RC0603JR-10100KL; POWER: 0.1W; RESISTANCE: 100k; TOLERANCE: 5%; VOLTAGE_CONTINUOUS: 75V; VOLTAGE_MAX: 75V
R14 R39 R44 = HyTechDevices - Copy:RESISTOR_?_*: Resistor PWR163 Series <https://www.mouser.com/datasheet/2/54/pwr163-777985.pdf> AC Series <https://www.mouser.com/datasheet/2/447/Yageo_PYu_AC_51_RoHS_L_7_1714230-1874691.pdf> PU Series <https://www.mouser.com/datasheet/2/447/PYu-PU_51_RoHS_L_6-1504619.pdf> ERA Series <https://www.mouser.com/datasheet/2/315/AOA0000C307-1149632.pdf> PWR263 Series <https://www.mouser.com/datasheet/2/54/pwr263s_35-778069.pdf> RC Series <https://www.mouser.com/datasheet/2/447/Yageo_03_18_2021_PYu_RC_Group_51_RoHS_L_11-2199992.pdf> ERJ PB3, PB6 Series <https://www.mouser.com/datasheet/2/315/AOA0000C328-1530132.pdf> ERJ PA2, P03, PA3, P06, P08, P14 Series <https://www.mouser.com/datasheet/2/315/AOA0000C331-1141874.pdf>; DKPN: 311-43.0KHRCT-ND; MANUFACTURER: Yageo; MOPN: 603-RC0603FR-0743KL; MPN: RC0603FR-0743KL; POWER: 0.1W; RESISTANCE: 43k; TOLERANCE: 1%; VOLTAGE_CONTINUOUS: 65.57V; VOLTAGE_MAX: 75V
R15 R30 R43 R45 R52 R63 R65 R67 R69 = HyTechDevices - Copy:RESISTOR_?_*: Resistor PWR163 Series <https://www.mouser.com/datasheet/2/54/pwr163-777985.pdf> AC Series <https://www.mouser.com/datasheet/2/447/Yageo_PYu_AC_51_RoHS_L_7_1714230-1874691.pdf> PU Series <https://www.mouser.com/datasheet/2/447/PYu-PU_51_RoHS_L_6-1504619.pdf> ERA Series <https://www.mouser.com/datasheet/2/315/AOA0000C307-1149632.pdf> PWR263 Series <https://www.mouser.com/datasheet/2/54/pwr263s_35-778069.pdf> RC Series <https://www.mouser.com/datasheet/2/447/Yageo_03_18_2021_PYu_RC_Group_51_RoHS_L_11-2199992.pdf> ERJ PB3, PB6 Series <https://www.mouser.com/datasheet/2/315/AOA0000C328-1530132.pdf> ERJ PA2, P03, PA3, P06, P08, P14 Series <https://www.mouser.com/datasheet/2/315/AOA0000C331-1141874.pdf>; DKPN: 311-12.0KHRCT-ND; MANUFACTURER: Yageo; MOPN: 603-RC0603FR-0712KL; MPN: RC0603FR-0712KL; POWER: 0.1W; RESISTANCE: 12k; TOLERANCE: 1%; VOLTAGE_CONTINUOUS: 34.64V; VOLTAGE_MAX: 75V
R16 R19 = HyTechDevices:RESISTOR_?_*: Resistor PWR163 Series <https://www.mouser.com/datasheet/2/54/pwr163-777985.pdf> AC Series <https://www.mouser.com/datasheet/2/447/Yageo_PYu_AC_51_RoHS_L_7_1714230-1874691.pdf> PU Series <https://www.mouser.com/datasheet/2/447/PYu-PU_51_RoHS_L_6-1504619.pdf> ERA Series <https://www.mouser.com/datasheet/2/315/AOA0000C307-1149632.pdf> PWR263 Series <https://www.mouser.com/datasheet/2/54/pwr263s_35-778069.pdf> RC Series <https://www.mouser.com/datasheet/2/447/Yageo_03_18_2021_PYu_RC_Group_51_RoHS_L_11-2199992.pdf> ERJ PB3, PB6 Series <https://www.mouser.com/datasheet/2/315/AOA0000C328-1530132.pdf> ERJ PA2, P03, PA3, P06, P08, P14 Series <https://www.mouser.com/datasheet/2/315/AOA0000C331-1141874.pdf>; DKPN: P10.2KDBCT-ND; MANUFACTURER: Panasonic Electronic Components; MOPN: 667-ERA-3AEB1022V; MPN: ERA-3AEB1022V; POWER: 0.1W; RESISTANCE: 10.2k; TOLERANCE: 0.1%; VOLTAGE_CONTINUOUS: 31.94V; VOLTAGE_MAX: 75V
R20 R25-R29 R33 = HyTechDevices:RESISTOR_?_*: Resistor PWR163 Series <https://www.mouser.com/datasheet/2/54/pwr163-777985.pdf> AC Series <https://www.mouser.com/datasheet/2/447/Yageo_PYu_AC_51_RoHS_L_7_1714230-1874691.pdf> PU Series <https://www.mouser.com/datasheet/2/447/PYu-PU_51_RoHS_L_6-1504619.pdf> ERA Series <https://www.mouser.com/datasheet/2/315/AOA0000C307-1149632.pdf> PWR263 Series <https://www.mouser.com/datasheet/2/54/pwr263s_35-778069.pdf> RC Series <https://www.mouser.com/datasheet/2/447/Yageo_03_18_2021_PYu_RC_Group_51_RoHS_L_11-2199992.pdf> ERJ PB3, PB6 Series <https://www.mouser.com/datasheet/2/315/AOA0000C328-1530132.pdf> ERJ PA2, P03, PA3, P06, P08, P14 Series <https://www.mouser.com/datasheet/2/315/AOA0000C331-1141874.pdf>; DKPN: P11.5KDBCT-ND; MANUFACTURER: Panasonic Electronic Components; MOPN: 667-ERA-3AEB1152V; MPN: ERA-3AEB1152V; POWER: 0.1W; RESISTANCE: 11.5k; TOLERANCE: 0.1%; VOLTAGE_CONTINUOUS: 33.91V; VOLTAGE_MAX: 75V
R21 R49 = HyTechDevices:RESISTOR_?_*: Resistor PWR163 Series <https://www.mouser.com/datasheet/2/54/pwr163-777985.pdf> AC Series <https://www.mouser.com/datasheet/2/447/Yageo_PYu_AC_51_RoHS_L_7_1714230-1874691.pdf> PU Series <https://www.mouser.com/datasheet/2/447/PYu-PU_51_RoHS_L_6-1504619.pdf> ERA Series <https://www.mouser.com/datasheet/2/315/AOA0000C307-1149632.pdf> PWR263 Series <https://www.mouser.com/datasheet/2/54/pwr263s_35-778069.pdf> RC Series <https://www.mouser.com/datasheet/2/447/Yageo_03_18_2021_PYu_RC_Group_51_RoHS_L_11-2199992.pdf> ERJ PB3, PB6 Series <https://www.mouser.com/datasheet/2/315/AOA0000C328-1530132.pdf> ERJ PA2, P03, PA3, P06, P08, P14 Series <https://www.mouser.com/datasheet/2/315/AOA0000C331-1141874.pdf>; DKPN: 311-10.0HRCT-ND; MANUFACTURER: Yageo; MOPN: 603-RC0603FR-0710RL; MPN: RC0603FR-0710RL; POWER: 0.1W; RESISTANCE: 10; TOLERANCE: 1%; VOLTAGE_CONTINUOUS: 1V; VOLTAGE_MAX: 75V
R24 = HyTechDevices:RESISTOR_?_*: Resistor PWR163 Series <https://www.mouser.com/datasheet/2/54/pwr163-777985.pdf> AC Series <https://www.mouser.com/datasheet/2/447/Yageo_PYu_AC_51_RoHS_L_7_1714230-1874691.pdf> PU Series <https://www.mouser.com/datasheet/2/447/PYu-PU_51_RoHS_L_6-1504619.pdf> ERA Series <https://www.mouser.com/datasheet/2/315/AOA0000C307-1149632.pdf> PWR263 Series <https://www.mouser.com/datasheet/2/54/pwr263s_35-778069.pdf> RC Series <https://www.mouser.com/datasheet/2/447/Yageo_03_18_2021_PYu_RC_Group_51_RoHS_L_11-2199992.pdf> ERJ PB3, PB6 Series <https://www.mouser.com/datasheet/2/315/AOA0000C328-1530132.pdf> ERJ PA2, P03, PA3, P06, P08, P14 Series <https://www.mouser.com/datasheet/2/315/AOA0000C331-1141874.pdf>; DKPN: P84.5KDBCT-ND; MANUFACTURER: Panasonic Electronic Components; MOPN: 667-ERA-3AEB8452V; MPN: ERA-3AEB8452V; POWER: 0.1W; RESISTANCE: 84.5k; TOLERANCE: 0.1%; VOLTAGE_CONTINUOUS: 75V; VOLTAGE_MAX: 75V
R34 = HyTechDevices - Copy:RESISTOR_?_*: Resistor PWR163 Series <https://www.mouser.com/datasheet/2/54/pwr163-777985.pdf> AC Series <https://www.mouser.com/datasheet/2/447/Yageo_PYu_AC_51_RoHS_L_7_1714230-1874691.pdf> PU Series <https://www.mouser.com/datasheet/2/447/PYu-PU_51_RoHS_L_6-1504619.pdf> ERA Series <https://www.mouser.com/datasheet/2/315/AOA0000C307-1149632.pdf> PWR263 Series <https://www.mouser.com/datasheet/2/54/pwr263s_35-778069.pdf> RC Series <https://www.mouser.com/datasheet/2/447/Yageo_03_18_2021_PYu_RC_Group_51_RoHS_L_11-2199992.pdf> ERJ PB3, PB6 Series <https://www.mouser.com/datasheet/2/315/AOA0000C328-1530132.pdf> ERJ PA2, P03, PA3, P06, P08, P14 Series <https://www.mouser.com/datasheet/2/315/AOA0000C331-1141874.pdf>; DKPN: P2.0KBDCT-ND; MANUFACTURER: Panasonic Electronic Components; MOPN: 667-ERA-3ARB202V; MPN: ERA-3ARB202V; POWER: 0.1W; RESISTANCE: 2k; TOLERANCE: 0.1%; VOLTAGE_CONTINUOUS: 14.14V; VOLTAGE_MAX: 75V
R35-R38 = HyTechDevices:RESISTOR_?_*: Resistor PWR163 Series <https://www.mouser.com/datasheet/2/54/pwr163-777985.pdf> AC Series <https://www.mouser.com/datasheet/2/447/Yageo_PYu_AC_51_RoHS_L_7_1714230-1874691.pdf> PU Series <https://www.mouser.com/datasheet/2/447/PYu-PU_51_RoHS_L_6-1504619.pdf> ERA Series <https://www.mouser.com/datasheet/2/315/AOA0000C307-1149632.pdf> PWR263 Series <https://www.mouser.com/datasheet/2/54/pwr263s_35-778069.pdf> RC Series <https://www.mouser.com/datasheet/2/447/Yageo_03_18_2021_PYu_RC_Group_51_RoHS_L_11-2199992.pdf> ERJ PB3, PB6 Series <https://www.mouser.com/datasheet/2/315/AOA0000C328-1530132.pdf> ERJ PA2, P03, PA3, P06, P08, P14 Series <https://www.mouser.com/datasheet/2/315/AOA0000C331-1141874.pdf>; DKPN: P10.5KDBCT-ND; MANUFACTURER: Panasonic Electronic Components; MOPN: 677-ERA-3AEB1052V; MPN: ERA-3AEB1052V; POWER: 0.1W; RESISTANCE: 10.5k; TOLERANCE: 0.1%; VOLTAGE_CONTINUOUS: 32.40V; VOLTAGE_MAX: 75V
R41 = HyTechDevices:RESISTOR_?_*: Resistor PWR163 Series <https://www.mouser.com/datasheet/2/54/pwr163-777985.pdf> AC Series <https://www.mouser.com/datasheet/2/447/Yageo_PYu_AC_51_RoHS_L_7_1714230-1874691.pdf> PU Series <https://www.mouser.com/datasheet/2/447/PYu-PU_51_RoHS_L_6-1504619.pdf> ERA Series <https://www.mouser.com/datasheet/2/315/AOA0000C307-1149632.pdf> PWR263 Series <https://www.mouser.com/datasheet/2/54/pwr263s_35-778069.pdf> RC Series <https://www.mouser.com/datasheet/2/447/Yageo_03_18_2021_PYu_RC_Group_51_RoHS_L_11-2199992.pdf> ERJ PB3, PB6 Series <https://www.mouser.com/datasheet/2/315/AOA0000C328-1530132.pdf> ERJ PA2, P03, PA3, P06, P08, P14 Series <https://www.mouser.com/datasheet/2/315/AOA0000C331-1141874.pdf>; DKPN: P215KDBCT-ND; MANUFACTURER: Panasonic Electronic Components; MOPN: 667-ERA-3AEB2153V; MPN: ERA-3AEB2153V; POWER: 0.1W; RESISTANCE: 215k; TOLERANCE: 0.1%; VOLTAGE_CONTINUOUS: 75V; VOLTAGE_MAX: 75V
R42 = HyTechDevices:RESISTOR_?_*: Resistor PWR163 Series <https://www.mouser.com/datasheet/2/54/pwr163-777985.pdf> AC Series <https://www.mouser.com/datasheet/2/447/Yageo_PYu_AC_51_RoHS_L_7_1714230-1874691.pdf> PU Series <https://www.mouser.com/datasheet/2/447/PYu-PU_51_RoHS_L_6-1504619.pdf> ERA Series <https://www.mouser.com/datasheet/2/315/AOA0000C307-1149632.pdf> PWR263 Series <https://www.mouser.com/datasheet/2/54/pwr263s_35-778069.pdf> RC Series <https://www.mouser.com/datasheet/2/447/Yageo_03_18_2021_PYu_RC_Group_51_RoHS_L_11-2199992.pdf> ERJ PB3, PB6 Series <https://www.mouser.com/datasheet/2/315/AOA0000C328-1530132.pdf> ERJ PA2, P03, PA3, P06, P08, P14 Series <https://www.mouser.com/datasheet/2/315/AOA0000C331-1141874.pdf>; DKPN: P11.3KDBCT-ND; MANUFACTURER: Panasonic Electronic Components; MOPN: 667-ERA-3AEB1132V; MPN: ERA-3AEB1132V; POWER: 0.1W; RESISTANCE: 11.3k; TOLERANCE: 0.1%; VOLTAGE_CONTINUOUS: 33.62V; VOLTAGE_MAX: 75V
R46 = HyTechDevices - Copy:RESISTOR_?_*: Resistor PWR163 Series <https://www.mouser.com/datasheet/2/54/pwr163-777985.pdf> AC Series <https://www.mouser.com/datasheet/2/447/Yageo_PYu_AC_51_RoHS_L_7_1714230-1874691.pdf> PU Series <https://www.mouser.com/datasheet/2/447/PYu-PU_51_RoHS_L_6-1504619.pdf> ERA Series <https://www.mouser.com/datasheet/2/315/AOA0000C307-1149632.pdf> PWR263 Series <https://www.mouser.com/datasheet/2/54/pwr263s_35-778069.pdf> RC Series <https://www.mouser.com/datasheet/2/447/Yageo_03_18_2021_PYu_RC_Group_51_RoHS_L_11-2199992.pdf> ERJ PB3, PB6 Series <https://www.mouser.com/datasheet/2/315/AOA0000C328-1530132.pdf> ERJ PA2, P03, PA3, P06, P08, P14 Series <https://www.mouser.com/datasheet/2/315/AOA0000C331-1141874.pdf>; DKPN: 13-RC0603DR-072K2LCT-ND; MANUFACTURER: Yageo; MOPN: 603-RC0603DR-072K2L; MPN: RC0603DR-072K2L; POWER: 0.1W; RESISTANCE: 2.2k; TOLERANCE: 0.5%; VOLTAGE_CONTINUOUS: 75V; VOLTAGE_MAX: 75V
R51 = HyTechDevices - Copy:RESISTOR_?_*: Resistor PWR163 Series <https://www.mouser.com/datasheet/2/54/pwr163-777985.pdf> AC Series <https://www.mouser.com/datasheet/2/447/Yageo_PYu_AC_51_RoHS_L_7_1714230-1874691.pdf> PU Series <https://www.mouser.com/datasheet/2/447/PYu-PU_51_RoHS_L_6-1504619.pdf> ERA Series <https://www.mouser.com/datasheet/2/315/AOA0000C307-1149632.pdf> PWR263 Series <https://www.mouser.com/datasheet/2/54/pwr263s_35-778069.pdf> RC Series <https://www.mouser.com/datasheet/2/447/Yageo_03_18_2021_PYu_RC_Group_51_RoHS_L_11-2199992.pdf> ERJ PB3, PB6 Series <https://www.mouser.com/datasheet/2/315/AOA0000C328-1530132.pdf> ERJ PA2, P03, PA3, P06, P08, P14 Series <https://www.mouser.com/datasheet/2/315/AOA0000C331-1141874.pdf>; DKPN: P30KBDCT-ND; MANUFACTURER: Panasonic Electronic Components; MOPN: 667-ERA-3ARB303V; MPN: ERA-3ARB303V; POWER: 0.1W; RESISTANCE: 30k; TOLERANCE: 0.1%; VOLTAGE_CONTINUOUS: 54.77V; VOLTAGE_MAX: 75V
R53 R83 = HyTechDevices - Copy:RESISTOR_?_*: Resistor PWR163 Series <https://www.mouser.com/datasheet/2/54/pwr163-777985.pdf> AC Series <https://www.mouser.com/datasheet/2/447/Yageo_PYu_AC_51_RoHS_L_7_1714230-1874691.pdf> PU Series <https://www.mouser.com/datasheet/2/447/PYu-PU_51_RoHS_L_6-1504619.pdf> ERA Series <https://www.mouser.com/datasheet/2/315/AOA0000C307-1149632.pdf> PWR263 Series <https://www.mouser.com/datasheet/2/54/pwr263s_35-778069.pdf> RC Series <https://www.mouser.com/datasheet/2/447/Yageo_03_18_2021_PYu_RC_Group_51_RoHS_L_11-2199992.pdf> ERJ PB3, PB6 Series <https://www.mouser.com/datasheet/2/315/AOA0000C328-1530132.pdf> ERJ PA2, P03, PA3, P06, P08, P14 Series <https://www.mouser.com/datasheet/2/315/AOA0000C331-1141874.pdf>; DKPN: 311-60.4HRCT-ND; MANUFACTURER: Yageo; MOPN: 603-RC0603FR-0760R4L; MPN: RC0603FR-0760R4L; POWER: 0.1W; RESISTANCE: 60.4; TOLERANCE: 1%; VOLTAGE_CONTINUOUS: 2.48V; VOLTAGE_MAX: 75V
R57 = HyTechDevices:RESISTOR_?_*: Resistor PWR163 Series <https://www.mouser.com/datasheet/2/54/pwr163-777985.pdf> AC Series <https://www.mouser.com/datasheet/2/447/Yageo_PYu_AC_51_RoHS_L_7_1714230-1874691.pdf> PU Series <https://www.mouser.com/datasheet/2/447/PYu-PU_51_RoHS_L_6-1504619.pdf> ERA Series <https://www.mouser.com/datasheet/2/315/AOA0000C307-1149632.pdf> PWR263 Series <https://www.mouser.com/datasheet/2/54/pwr263s_35-778069.pdf> RC Series <https://www.mouser.com/datasheet/2/447/Yageo_03_18_2021_PYu_RC_Group_51_RoHS_L_11-2199992.pdf> ERJ PB3, PB6 Series <https://www.mouser.com/datasheet/2/315/AOA0000C328-1530132.pdf> ERJ PA2, P03, PA3, P06, P08, P14 Series <https://www.mouser.com/datasheet/2/315/AOA0000C331-1141874.pdf>; DKPN: P470BYCT-ND; MANUFACTURER: Panasonic Electronic Components; MOPN: 667-ERJ-PA3F4700V; MPN: ERJ-PA3F4700V; POWER: 0.25W; RESISTANCE: 470; TOLERANCE: 1%; VOLTAGE_CONTINUOUS: 10.84V; VOLTAGE_MAX: 150V
R71 R75 R76 = HyTechDevices - Copy:RESISTOR_?_*: Resistor PWR163 Series <https://www.mouser.com/datasheet/2/54/pwr163-777985.pdf> AC Series <https://www.mouser.com/datasheet/2/447/Yageo_PYu_AC_51_RoHS_L_7_1714230-1874691.pdf> PU Series <https://www.mouser.com/datasheet/2/447/PYu-PU_51_RoHS_L_6-1504619.pdf> ERA Series <https://www.mouser.com/datasheet/2/315/AOA0000C307-1149632.pdf> PWR263 Series <https://www.mouser.com/datasheet/2/54/pwr263s_35-778069.pdf> RC Series <https://www.mouser.com/datasheet/2/447/Yageo_03_18_2021_PYu_RC_Group_51_RoHS_L_11-2199992.pdf> ERJ PB3, PB6 Series <https://www.mouser.com/datasheet/2/315/AOA0000C328-1530132.pdf> ERJ PA2, P03, PA3, P06, P08, P14 Series <https://www.mouser.com/datasheet/2/315/AOA0000C331-1141874.pdf>; DKPN: P470BYCT-ND; MANUFACTURER: Panasonic Electronic Components; MOPN: 667-ERJ-PA3F4700V; MPN: ERJ-PA3F4700V; POWER: 0.25W; RESISTANCE: 470; TOLERANCE: 1%; VOLTAGE_CONTINUOUS: 10.84V; VOLTAGE_MAX: 150V
RN1 = HyTechDevices - Copy:RESISTOR_NETWORK_4_*: Resistor Network, 4 Elements YC/TC Series <https://www.mouser.com/datasheet/2/447/yageo_yago_s_a0009164376_1-1991537.pdf> CAT/CAY 16 Series <https://www.mouser.com/datasheet/2/54/CATCAY-777361.pdf>; DKPN: CAT16-1000F4LFCT-ND; MANUFACTURER: Bourns Inc.; MOPN: 652-CAT16-1000F4LF; MPN: CAT16-1000F4LF; POWER: 1/16W; RESISTANCE: 100; TOLERANCE: 1%; VOLTAGE: 50V
T1 = HyTechDevices - Copy:TRANSFORMER: 2 Channel SMT Transformer Specs for both HM2102NL and HM2112ZNL Transformers Turns ratio: 1CT: 1CT Isolation Voltage: 4300 VDC Inductance: 150 uH Leakage Inductance: 0.50 uH max HM2102NLT: DataSheet <https://www.mouser.com/datasheet/2/336/HM2102NL-1218600.pdf> HM2112ZNLT: DataSheet <https://www.mouser.com/datasheet/2/336/HM2112ZNL-1224892.pdf>; DKPN: 1840-1036-1-ND; MANUFACTURER: Pulse Electronics; MOPN: 673-HM2112ZNLT; MPN: HM2112ZNLT
U1 U16 U$2 = HyTechDevices:RELAY_SOLIDSTATE_NO: AQY214EH Normally Open Solid State Relay Datasheet <https://www.datasheetq.com/datasheet-download/287654/1/Panasonic/AQY214EH>; MPN: AQY214EHA
U2 = HyTechDevices:ADG1423: ADG1423 Form-A/Form-C Analog Switch Datasheet <https://www.mouser.com/datasheet/2/609/ADG1421_1422_1423-1502752.pdf>; DKPN: ADG1423BRMZ-REEL7CT-ND; MANUFACTURER: Analog Devices Inc.; MOPN: 584-ADG1423BRMZ; MPN: ADG1423BRMZ
U3 = HyTechDevices:*555: **555 Precision Timer NA555, NE555, SA555, SE555 <https://www.ti.com/lit/ds/symlink/na555.pdf> LM555 <https://www.ti.com/lit/ds/symlink/lm555.pdf>; DKPN: LM555CMX/NOPBCT-ND; MANUFACTURER: Texas Instruments; MOPN: 926-LM555CMX/NOPB; MPN: LM555CMX/NOPB
U4 U7 U9 U10 U12-U14 U18 U20 U22 U27 U29 = HyTechDevices:OPAMP_1_CHANNEL_*: Op-Amp 1 Channel OPA991 Datasheet <https://www.ti.com/lit/ds/symlink/opa991.pdf?ts=1615503614502> Note: OPA991 is also a comparator; DKPN: 296-OPA991IDCKRCT-ND; MANUFACTURER: Texas Instruments; MOPN: 595-OPA991IDCKR; MPN: OPA991IDCKR
U5 = HyTechDevices - Copy:LTC6820: LTC6820 isoSPI Isolated Communications Interface Datasheet <mouser.com/datasheet/2/609/LTC6820-1601976.pdf>; MANUFACTURER: Analog Devices; MPN: LTC6820IMS#PBF
U6 = HyTechDevices - Copy:ADM823: ADM823 Watchdog Datasheet <https://www.mouser.com/datasheet/2/609/ADM823_824_825-1503117.pdf>; DKPN: 505-ADM823TYKSZ-R7CT-ND; MANUFACTURER: Analog Devices Inc.; MOPN: 584-ADM823TYKSZ-R7; MPN: ADM823TYKSZ-R7; RESET_VOLTAGE: 3.08
U8 U11 U15 = HyTechDevices:LOGICGATE_AND_: AND Gate SN74LVC Datasheet <https://www.ti.com/lit/ds/symlink/sn74lvc1g08.pdf>; DKPN: 296-SN74LVC1G08DCK3TR-ND; MANUFACTURER: Texas Instruments; MOPN: 595-SN74LVC1G08DCK3; MPN: SN74LVC1G08DCK3
U17 = HyTechDevices - Copy:VOLTAGE_REGULATOR_?_*: Voltage Regulators LDL1117S50R Datasheet <https://www.mouser.com/datasheet/2/389/dm00366442-1799212.pdf> NCP785AH120T1G <https://www.mouser.com/datasheet/2/308/NCP785A_D-1812704.pdf>; DKPN: 497-17239-1-ND; MANUFACTURER: STMicroelectronics; MOPN: 511-LDL1117S33R; MPN: LDL1117S33R
U19 U26 U28 U30 = HyTechDevices:MAX74*: 8th-Order Maxim Filter MAX7480 Datasheet <https://www.mouser.com/datasheet/2/256/MAX7480-1515905.pdf> MAX7400 Datsheet <https://www.mouser.com/datasheet/2/256/MAX7404-1514314.pdf> MAX7400, 7404 uses a 680 pF clock capcitor; DKPN: MAX7404CSA+-ND; MANUFACTURER: Maxim Integrated; MOPN: 700-MAX7404CSA; MPN: MAX7404CSA+
U25 = HyTechDevices:TCAN1051*V-Q1: TCAN1051*V Can Tranciever Datasheet <https://www.ti.com/lit/ds/symlink/tcan1051hgv-q1.pdf?HQS=dis-mous-null-mousermode-dsf-pf-null-wwe&ts=1610765132518&ref_url=https%253A%252F%252Fwww.mouser.com%252Ff>; DKPN: 296-49935-1-ND; MANUFACTURER: Texas Instruments; MOPN: 595-TCAN1051HGVDQ1; MPN: TCAN1051HGVDRQ1